# EAGLE design Modular-Sensor-Breakout-Board2 (EAGLE 5.12)

## Sheet 1 of 7
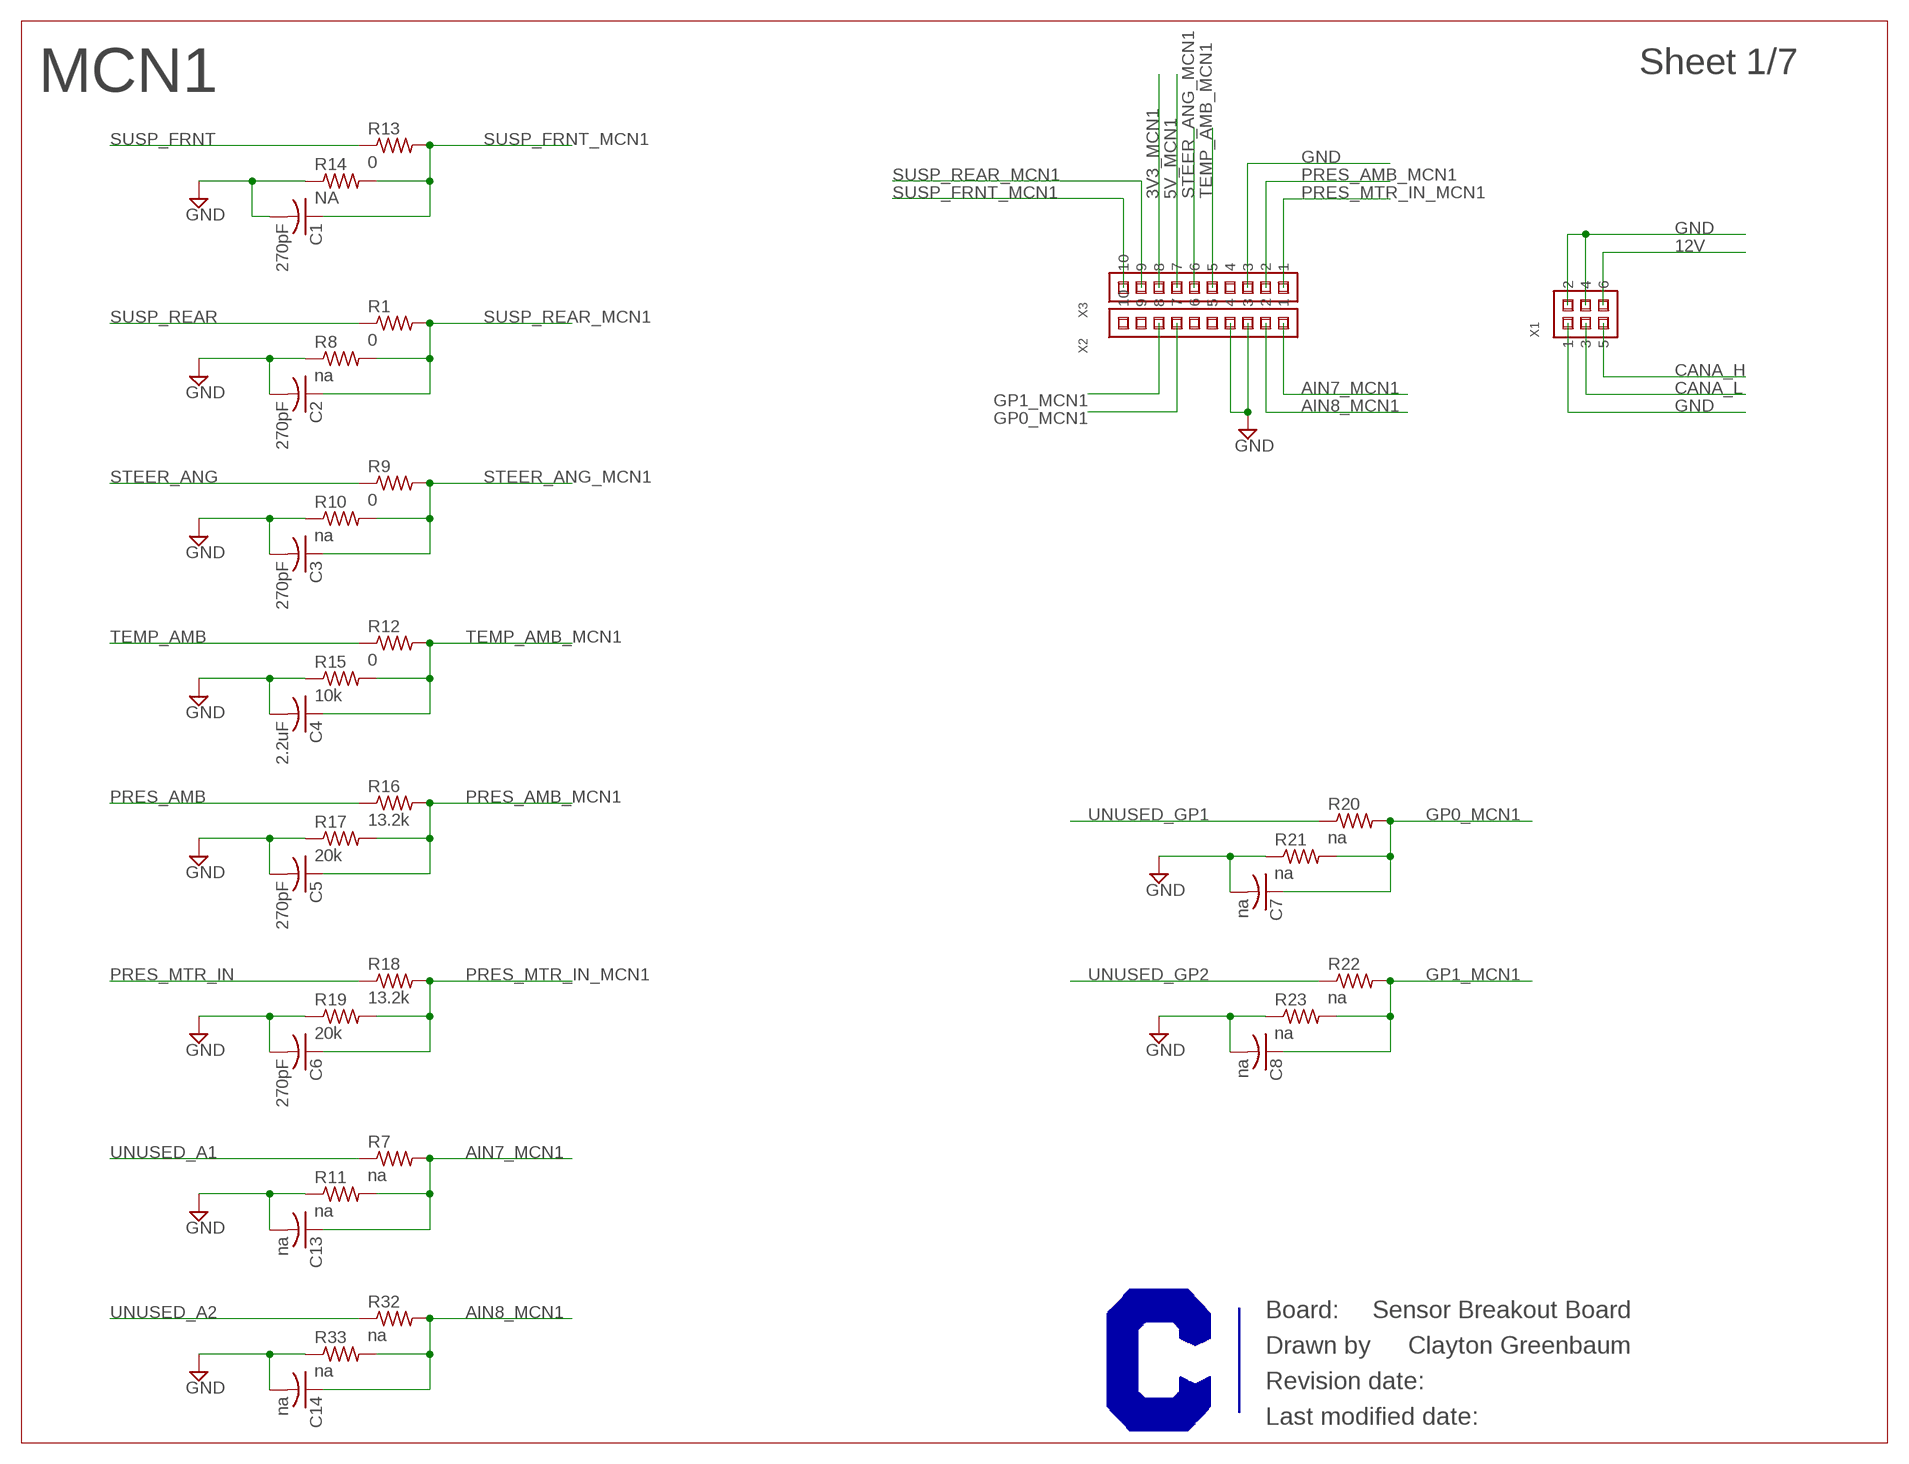
[diagram p0: schematic, sheet 1]

### Parts
C1  270pF  C-USC0603  [C0603]
C2  270pF  C-USC0603  [C0603]
C3  270pF  C-USC0603  [C0603]
C4  2.2uF  C-USC0603  [C0603]
C5  270pF  C-USC0603  [C0603]
C6  270pF  C-USC0603  [C0603]
C7  na  C-USC0603  [C0603]
C8  na  C-USC0603  [C0603]
C13  na  C-USC0603  [C0603]
C14  na  C-USC0603  [C0603]
R1  0  R-US_R0603  [R0603]
R7  na  R-US_R0603  [R0603]
R8  na  R-US_R0603  [R0603]
R9  0  R-US_R0603  [R0603]
R10  na  R-US_R0603  [R0603]
R11  na  R-US_R0603  [R0603]
R12  0  R-US_R0603  [R0603]
R13  0  R-US_R0603  [R0603]
R14  NA  R-US_R0603  [R0603]
R15  10k  R-US_R0603  [R0603]
R16  13.2k  R-US_R0603  [R0603]
R17  20k  R-US_R0603  [R0603]
R18  13.2k  R-US_R0603  [R0603]
R19  20k  R-US_R0603  [R0603]
R20  na  R-US_R0603  [R0603]
R21  na  R-US_R0603  [R0603]
R22  na  R-US_R0603  [R0603]
R23  na  R-US_R0603  [R0603]
R32  na  R-US_R0603  [R0603]
R33  na  R-US_R0603  [R0603]
X1  M22-71403XX  [M22-71403XX]
X2  M22-71310XX  [M22-71310XX]
X3  M22-71310XX  [M22-71310XX]

### Nets
3V3_MCN1: X3.8 ; also sheet 7
5V_MCN1: X3.7 ; also sheet 7
12V: X1.6 ; also sheet 2,3,4,5,6,7
AIN7_MCN1: C13.1 R7.2 R11.2 X2.1
AIN8_MCN1: C14.1 R32.2 R33.2 X2.2
CANA_H: X1.5 ; also sheet 2,3,5,6,7
CANA_L: X1.3 ; also sheet 2,3,5,6,7
GND: C1.2 C2.2 C3.2 C4.2 C5.2 C6.2 C7.2 C8.2 C13.2 C14.2 R8.1 R10.1 R11.1 R14.1 R15.1 R17.1 R19.1 R21.1 R23.1 R33.1 X1.1 X1.2 X1.4 X2.3 X2.4 X3.3 ; also sheet 2,3,4,5,6,7
GP0_MCN1: C7.1 R20.2 R21.2 X2.7
GP1_MCN1: C8.1 R22.2 R23.2 X2.8
PRES_AMB: R16.1 ; also sheet 7
PRES_AMB_MCN1: C5.1 R16.2 R17.2 X3.2
PRES_MTR_IN: R18.1 ; also sheet 7
PRES_MTR_IN_MCN1: C6.1 R18.2 R19.2 X3.1
STEER_ANG: R9.1 ; also sheet 7
STEER_ANG_MCN1: C3.1 R9.2 R10.2 X3.6
SUSP_FRNT: R13.1 ; also sheet 7
SUSP_FRNT_MCN1: C1.1 R13.2 R14.2 X3.10
SUSP_REAR: R1.1 ; also sheet 7
SUSP_REAR_MCN1: C2.1 R1.2 R8.2 X3.9
TEMP_AMB: R12.1 ; also sheet 7
TEMP_AMB_MCN1: C4.1 R12.2 R15.2 X3.5
UNUSED_A1: R7.1 ; also sheet 7
UNUSED_A2: R32.1 ; also sheet 7
UNUSED_GP1: R20.1 ; also sheet 7
UNUSED_GP2: R22.1 ; also sheet 7
Unconnected: X2.5 X2.6 X2.9 X2.10 X3.4

### Notes on the sheet
- MCN1
- Sensor Breakout Board
- Clayton Greenbaum

## Sheet 2 of 7
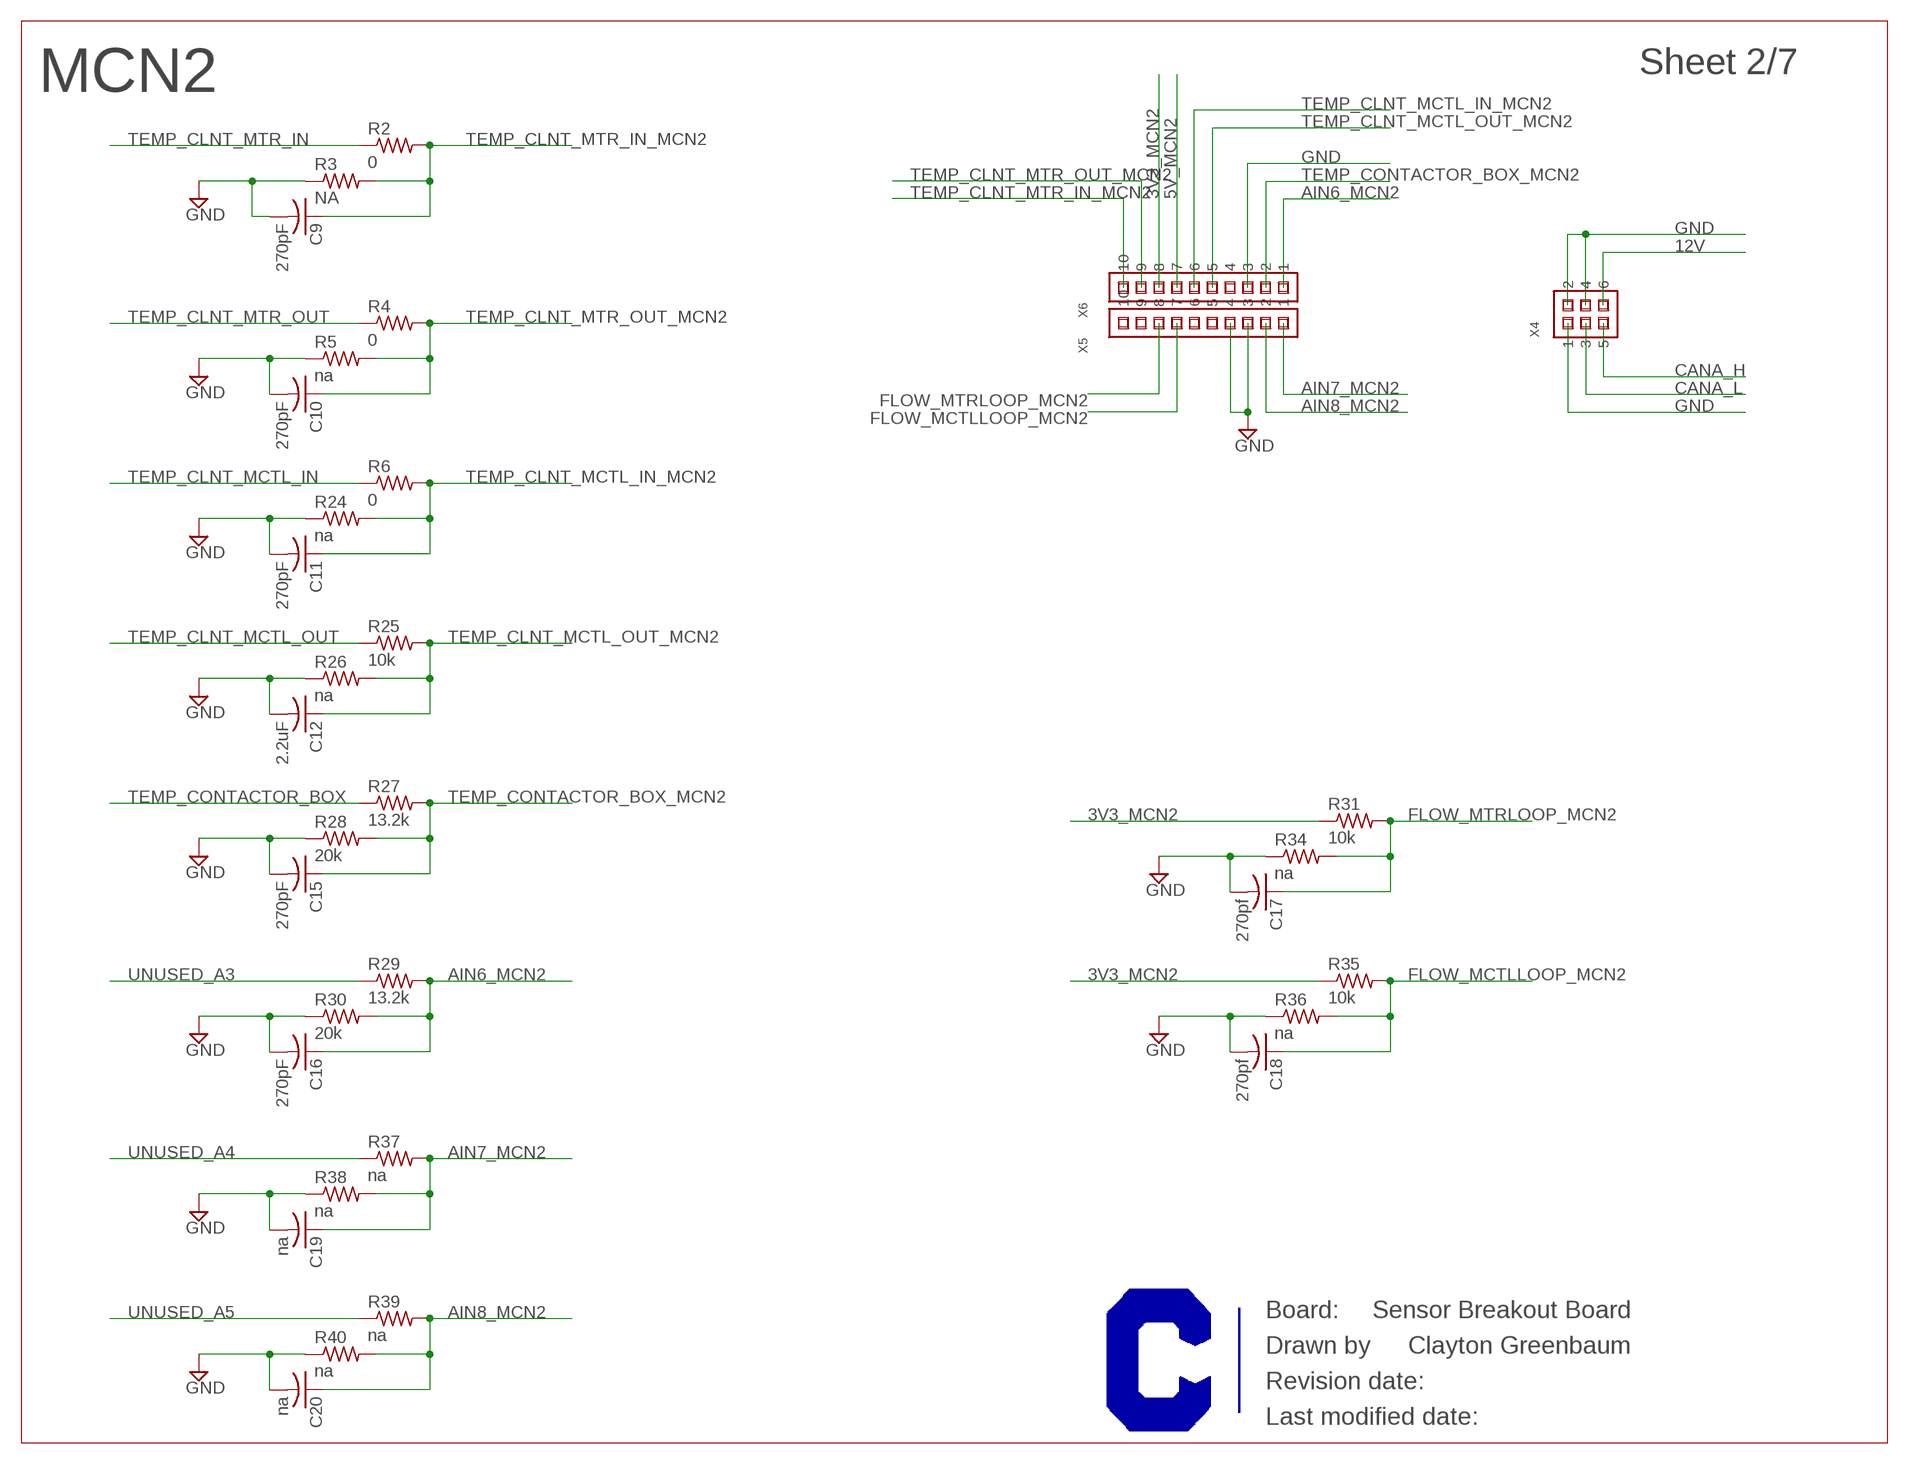
[diagram p1: schematic, sheet 2]

### Parts
C9  270pF  C-USC0603  [C0603]
C10  270pF  C-USC0603  [C0603]
C11  270pF  C-USC0603  [C0603]
C12  2.2uF  C-USC0603  [C0603]
C15  270pF  C-USC0603  [C0603]
C16  270pF  C-USC0603  [C0603]
C17  270pf  C-USC0603  [C0603]
C18  270pf  C-USC0603  [C0603]
C19  na  C-USC0603  [C0603]
C20  na  C-USC0603  [C0603]
R2  0  R-US_R0603  [R0603]
R3  NA  R-US_R0603  [R0603]
R4  0  R-US_R0603  [R0603]
R5  na  R-US_R0603  [R0603]
R6  0  R-US_R0603  [R0603]
R24  na  R-US_R0603  [R0603]
R25  10k  R-US_R0603  [R0603]
R26  na  R-US_R0603  [R0603]
R27  13.2k  R-US_R0603  [R0603]
R28  20k  R-US_R0603  [R0603]
R29  13.2k  R-US_R0603  [R0603]
R30  20k  R-US_R0603  [R0603]
R31  10k  R-US_R0603  [R0603]
R34  na  R-US_R0603  [R0603]
R35  10k  R-US_R0603  [R0603]
R36  na  R-US_R0603  [R0603]
R37  na  R-US_R0603  [R0603]
R38  na  R-US_R0603  [R0603]
R39  na  R-US_R0603  [R0603]
R40  na  R-US_R0603  [R0603]
X4  M22-71403XX  [M22-71403XX]
X5  M22-71310XX  [M22-71310XX]
X6  M22-71310XX  [M22-71310XX]

### Nets
3V3_MCN2: R31.1 R35.1 X6.8 ; also sheet 7
5V_MCN2: X6.7 ; also sheet 7
12V: X4.6 ; also sheet 1,3,4,5,6,7
AIN6_MCN2: C16.1 R29.2 R30.2 X6.1
AIN7_MCN2: C19.1 R37.2 R38.2 X5.1
AIN8_MCN2: C20.1 R39.2 R40.2 X5.2
CANA_H: X4.5 ; also sheet 1,3,5,6,7
CANA_L: X4.3 ; also sheet 1,3,5,6,7
FLOW_MCTLLOOP_MCN2: C18.1 R35.2 R36.2 X5.7
FLOW_MTRLOOP_MCN2: C17.1 R31.2 R34.2 X5.8
GND: C9.2 C10.2 C11.2 C12.2 C15.2 C16.2 C17.2 C18.2 C19.2 C20.2 R3.1 R5.1 R24.1 R26.1 R28.1 R30.1 R34.1 R36.1 R38.1 R40.1 X4.1 X4.2 X4.4 X5.3 X5.4 X6.3 ; also sheet 1,3,4,5,6,7
TEMP_CLNT_MCTL_IN: R6.1
TEMP_CLNT_MCTL_IN_MCN2: C11.1 R6.2 R24.2 X6.6
TEMP_CLNT_MCTL_OUT: R25.1
TEMP_CLNT_MCTL_OUT_MCN2: C12.1 R25.2 R26.2 X6.5
TEMP_CLNT_MTR_IN: R2.1
TEMP_CLNT_MTR_IN_MCN2: C9.1 R2.2 R3.2 X6.10
TEMP_CLNT_MTR_OUT: R4.1
TEMP_CLNT_MTR_OUT_MCN2: C10.1 R4.2 R5.2 X6.9
TEMP_CONTACTOR_BOX: R27.1
TEMP_CONTACTOR_BOX_MCN2: C15.1 R27.2 R28.2 X6.2
UNUSED_A3: R29.1
UNUSED_A4: R37.1
UNUSED_A5: R39.1 ; also sheet 3
Unconnected: X5.5 X5.6 X5.9 X5.10 X6.4

### Notes on the sheet
- MCN2
- Sensor Breakout Board
- Clayton Greenbaum

## Sheet 3 of 7
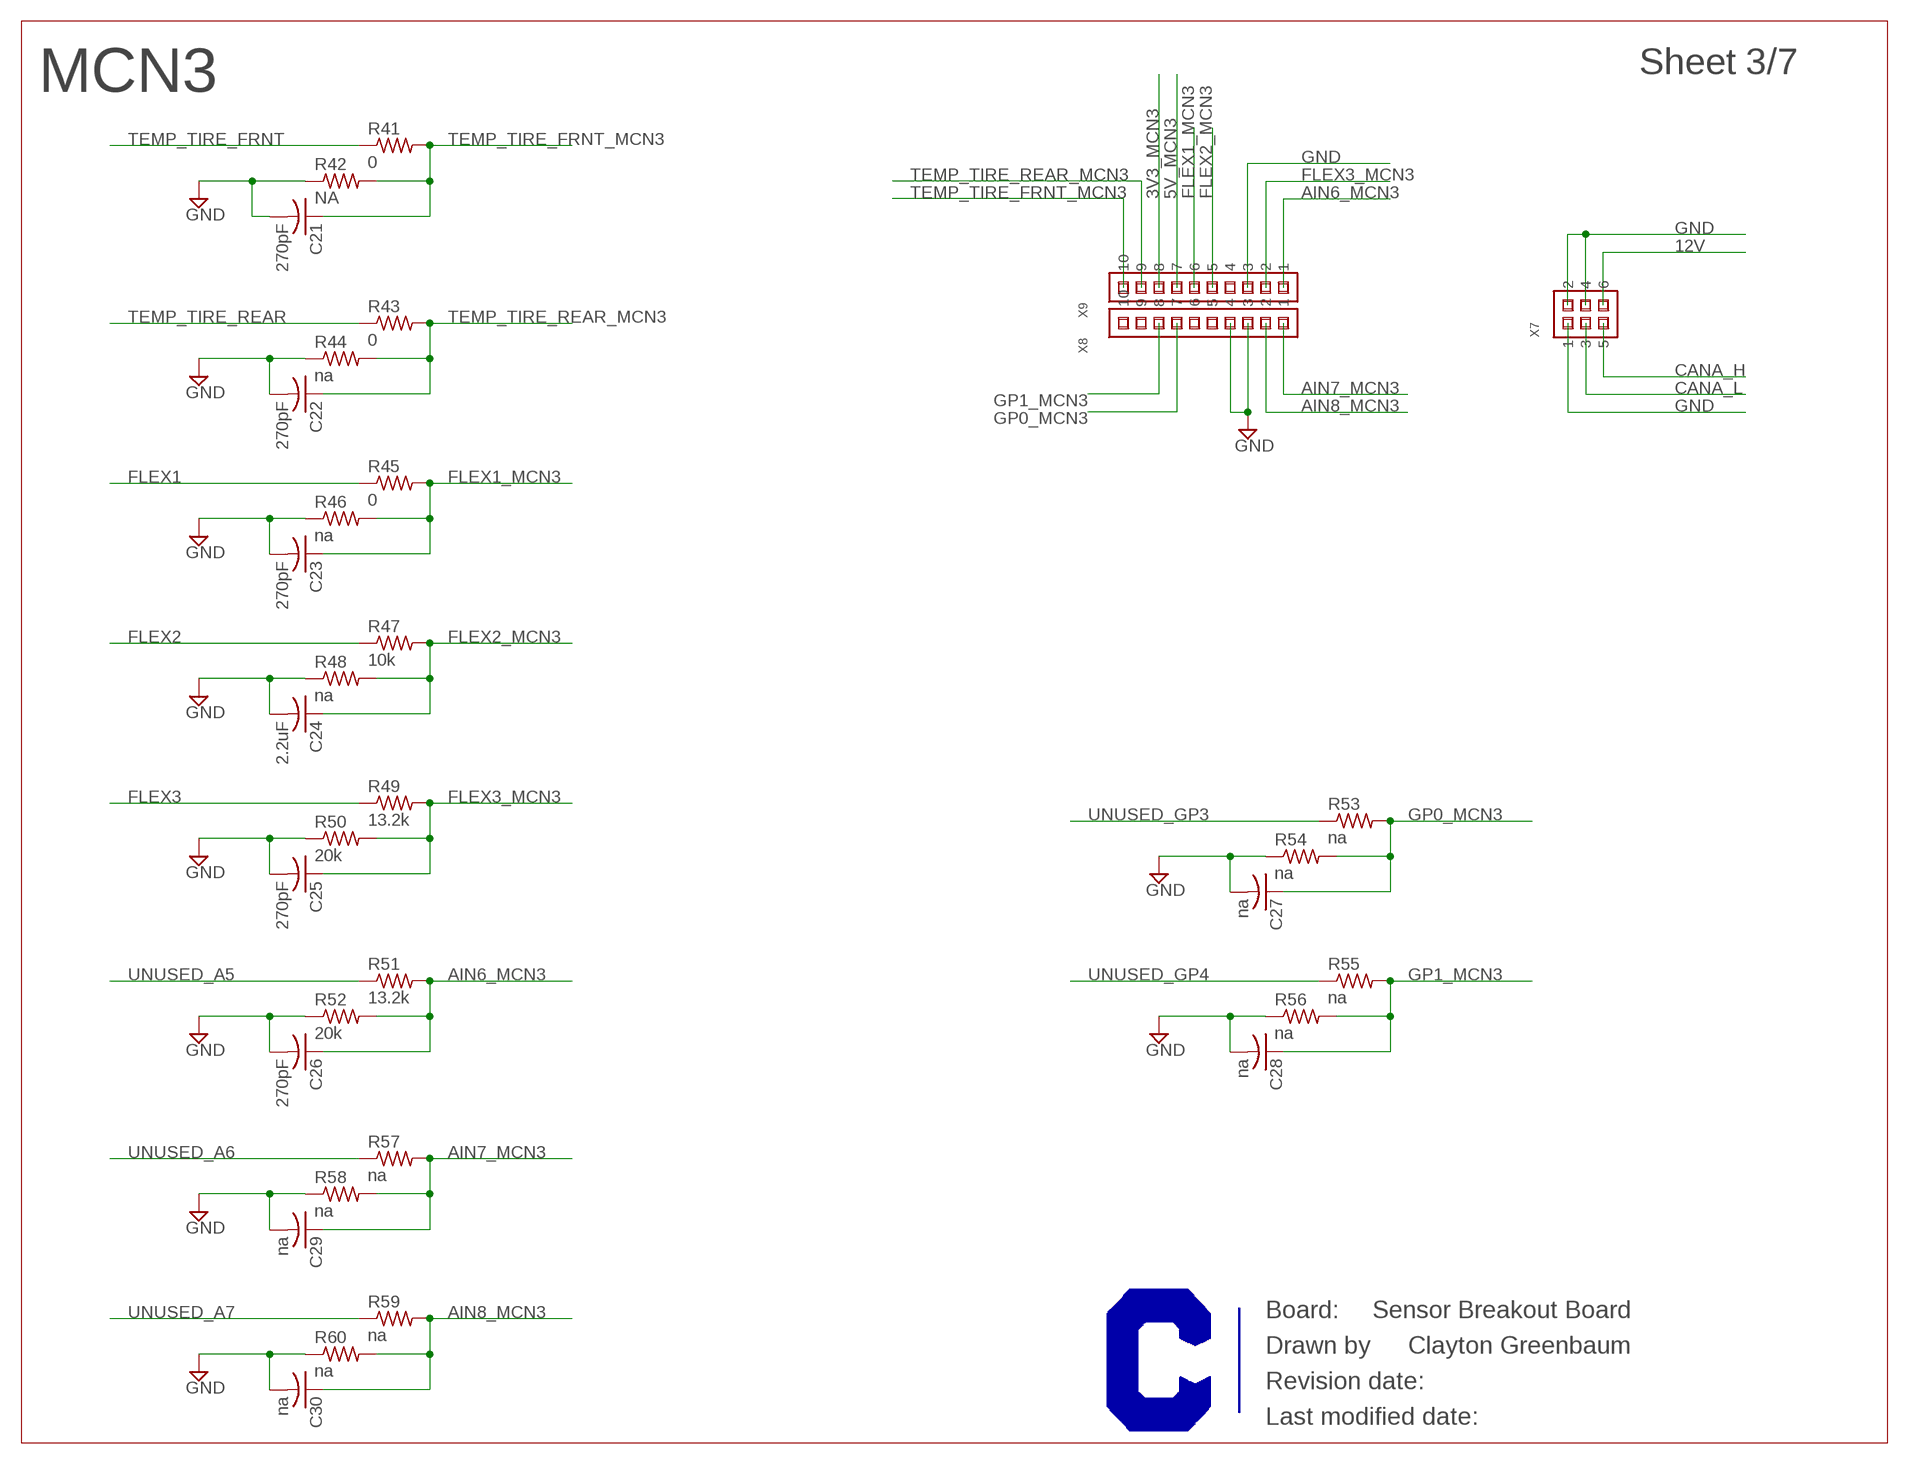
[diagram p2: schematic, sheet 3]

### Parts
C21  270pF  C-USC0603  [C0603]
C22  270pF  C-USC0603  [C0603]
C23  270pF  C-USC0603  [C0603]
C24  2.2uF  C-USC0603  [C0603]
C25  270pF  C-USC0603  [C0603]
C26  270pF  C-USC0603  [C0603]
C27  na  C-USC0603  [C0603]
C28  na  C-USC0603  [C0603]
C29  na  C-USC0603  [C0603]
C30  na  C-USC0603  [C0603]
R41  0  R-US_R0603  [R0603]
R42  NA  R-US_R0603  [R0603]
R43  0  R-US_R0603  [R0603]
R44  na  R-US_R0603  [R0603]
R45  0  R-US_R0603  [R0603]
R46  na  R-US_R0603  [R0603]
R47  10k  R-US_R0603  [R0603]
R48  na  R-US_R0603  [R0603]
R49  13.2k  R-US_R0603  [R0603]
R50  20k  R-US_R0603  [R0603]
R51  13.2k  R-US_R0603  [R0603]
R52  20k  R-US_R0603  [R0603]
R53  na  R-US_R0603  [R0603]
R54  na  R-US_R0603  [R0603]
R55  na  R-US_R0603  [R0603]
R56  na  R-US_R0603  [R0603]
R57  na  R-US_R0603  [R0603]
R58  na  R-US_R0603  [R0603]
R59  na  R-US_R0603  [R0603]
R60  na  R-US_R0603  [R0603]
X7  M22-71403XX  [M22-71403XX]
X8  M22-71310XX  [M22-71310XX]
X9  M22-71310XX  [M22-71310XX]

### Nets
3V3_MCN3: X9.8 ; also sheet 7
5V_MCN3: X9.7 ; also sheet 7
12V: X7.6 ; also sheet 1,2,4,5,6,7
AIN6_MCN3: C26.1 R51.2 R52.2 X9.1
AIN7_MCN3: C29.1 R57.2 R58.2 X8.1
AIN8_MCN3: C30.1 R59.2 R60.2 X8.2
CANA_H: X7.5 ; also sheet 1,2,5,6,7
CANA_L: X7.3 ; also sheet 1,2,5,6,7
FLEX1: R45.1
FLEX1_MCN3: C23.1 R45.2 R46.2 X9.6
FLEX2: R47.1
FLEX2_MCN3: C24.1 R47.2 R48.2 X9.5
FLEX3: R49.1
FLEX3_MCN3: C25.1 R49.2 R50.2 X9.2
GND: C21.2 C22.2 C23.2 C24.2 C25.2 C26.2 C27.2 C28.2 C29.2 C30.2 R42.1 R44.1 R46.1 R48.1 R50.1 R52.1 R54.1 R56.1 R58.1 R60.1 X7.1 X7.2 X7.4 X8.3 X8.4 X9.3 ; also sheet 1,2,4,5,6,7
GP0_MCN3: C27.1 R53.2 R54.2 X8.7
GP1_MCN3: C28.1 R55.2 R56.2 X8.8
TEMP_TIRE_FRNT: R41.1
TEMP_TIRE_FRNT_MCN3: C21.1 R41.2 R42.2 X9.10
TEMP_TIRE_REAR: R43.1
TEMP_TIRE_REAR_MCN3: C22.1 R43.2 R44.2 X9.9
UNUSED_A5: R51.1 ; also sheet 2
UNUSED_A6: R57.1
UNUSED_A7: R59.1
UNUSED_GP3: R53.1
UNUSED_GP4: R55.1
Unconnected: X8.5 X8.6 X8.9 X8.10 X9.4

### Notes on the sheet
- MCN3
- Sensor Breakout Board
- Clayton Greenbaum

## Sheet 4 of 7
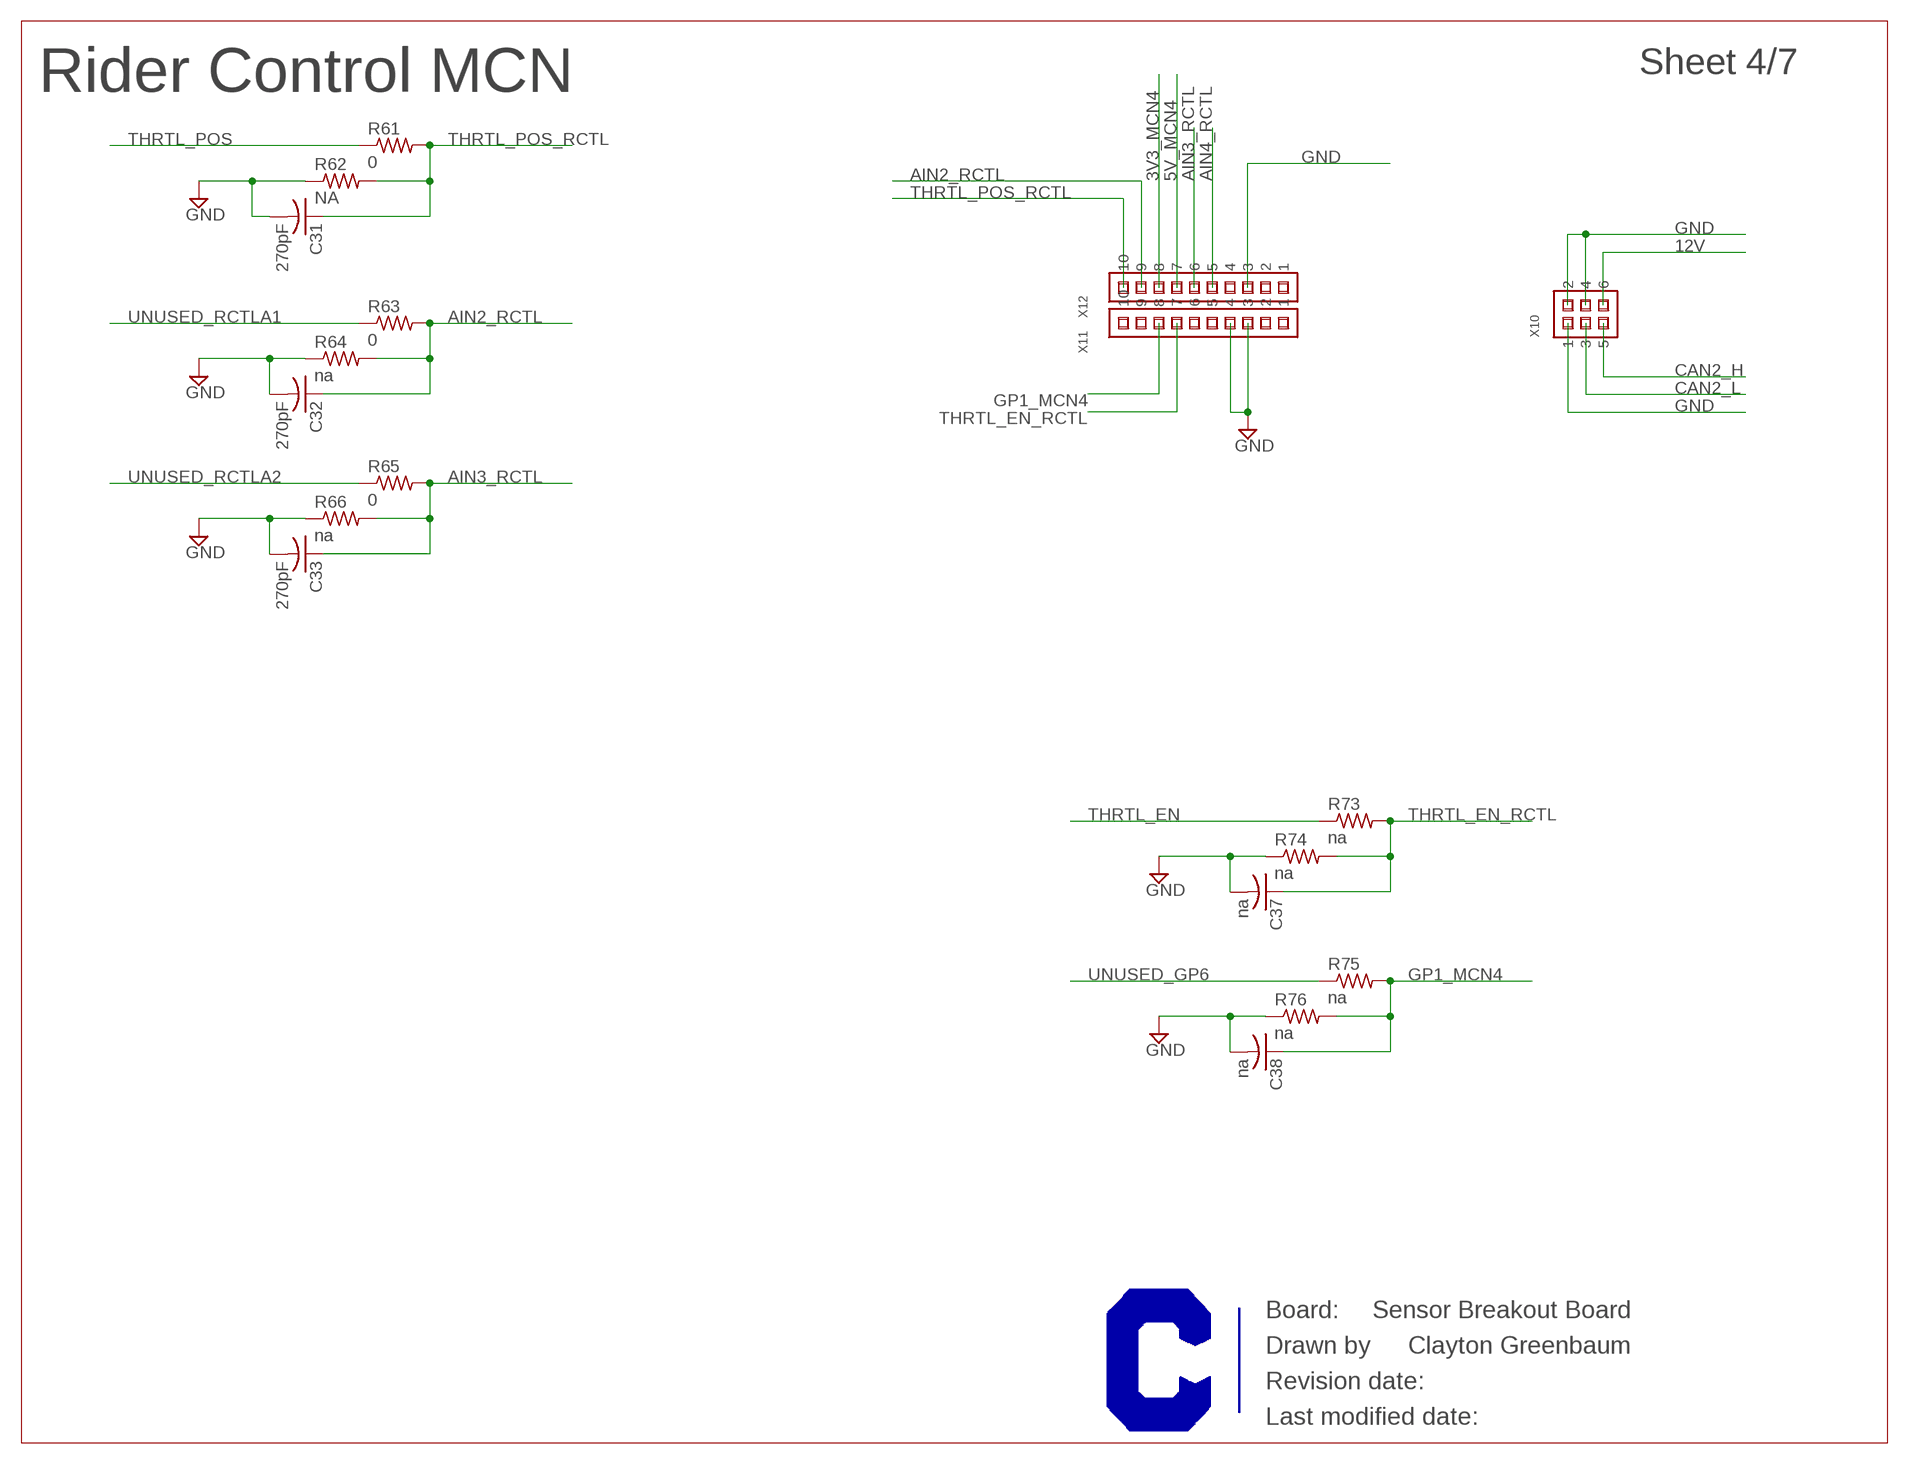
[diagram p3: schematic, sheet 4]

### Parts
C31  270pF  C-USC0603  [C0603]
C32  270pF  C-USC0603  [C0603]
C33  270pF  C-USC0603  [C0603]
C37  na  C-USC0603  [C0603]
C38  na  C-USC0603  [C0603]
R61  0  R-US_R0603  [R0603]
R62  NA  R-US_R0603  [R0603]
R63  0  R-US_R0603  [R0603]
R64  na  R-US_R0603  [R0603]
R65  0  R-US_R0603  [R0603]
R66  na  R-US_R0603  [R0603]
R73  na  R-US_R0603  [R0603]
R74  na  R-US_R0603  [R0603]
R75  na  R-US_R0603  [R0603]
R76  na  R-US_R0603  [R0603]
X10  M22-71403XX  [M22-71403XX]
X11  M22-71310XX  [M22-71310XX]
X12  M22-71310XX  [M22-71310XX]

### Nets
3V3_MCN4: X12.8
5V_MCN4: X12.7
12V: X10.6 ; also sheet 1,2,3,5,6,7
AIN2_RCTL: C32.1 R63.2 R64.2 X12.9
AIN3_RCTL: C33.1 R65.2 R66.2 X12.6
AIN4_RCTL: X12.5
CAN2_H: X10.5 ; also sheet 6,7
CAN2_L: X10.3 ; also sheet 6,7
GND: C31.2 C32.2 C33.2 C37.2 C38.2 R62.1 R64.1 R66.1 R74.1 R76.1 X10.1 X10.2 X10.4 X11.3 X11.4 X12.3 ; also sheet 1,2,3,5,6,7
GP1_MCN4: C38.1 R75.2 R76.2 X11.8
THRTL_EN: R73.1
THRTL_EN_RCTL: C37.1 R73.2 R74.2 X11.7
THRTL_POS: R61.1
THRTL_POS_RCTL: C31.1 R61.2 R62.2 X12.10
UNUSED_GP6: R75.1
UNUSED_RCTLA1: R63.1
UNUSED_RCTLA2: R65.1
Unconnected: X11.1 X11.2 X11.5 X11.6 X11.9 X11.10 X12.1 X12.2 X12.4

### Notes on the sheet
- Rider Control MCN
- Sensor Breakout Board
- Clayton Greenbaum

## Sheet 5 of 7
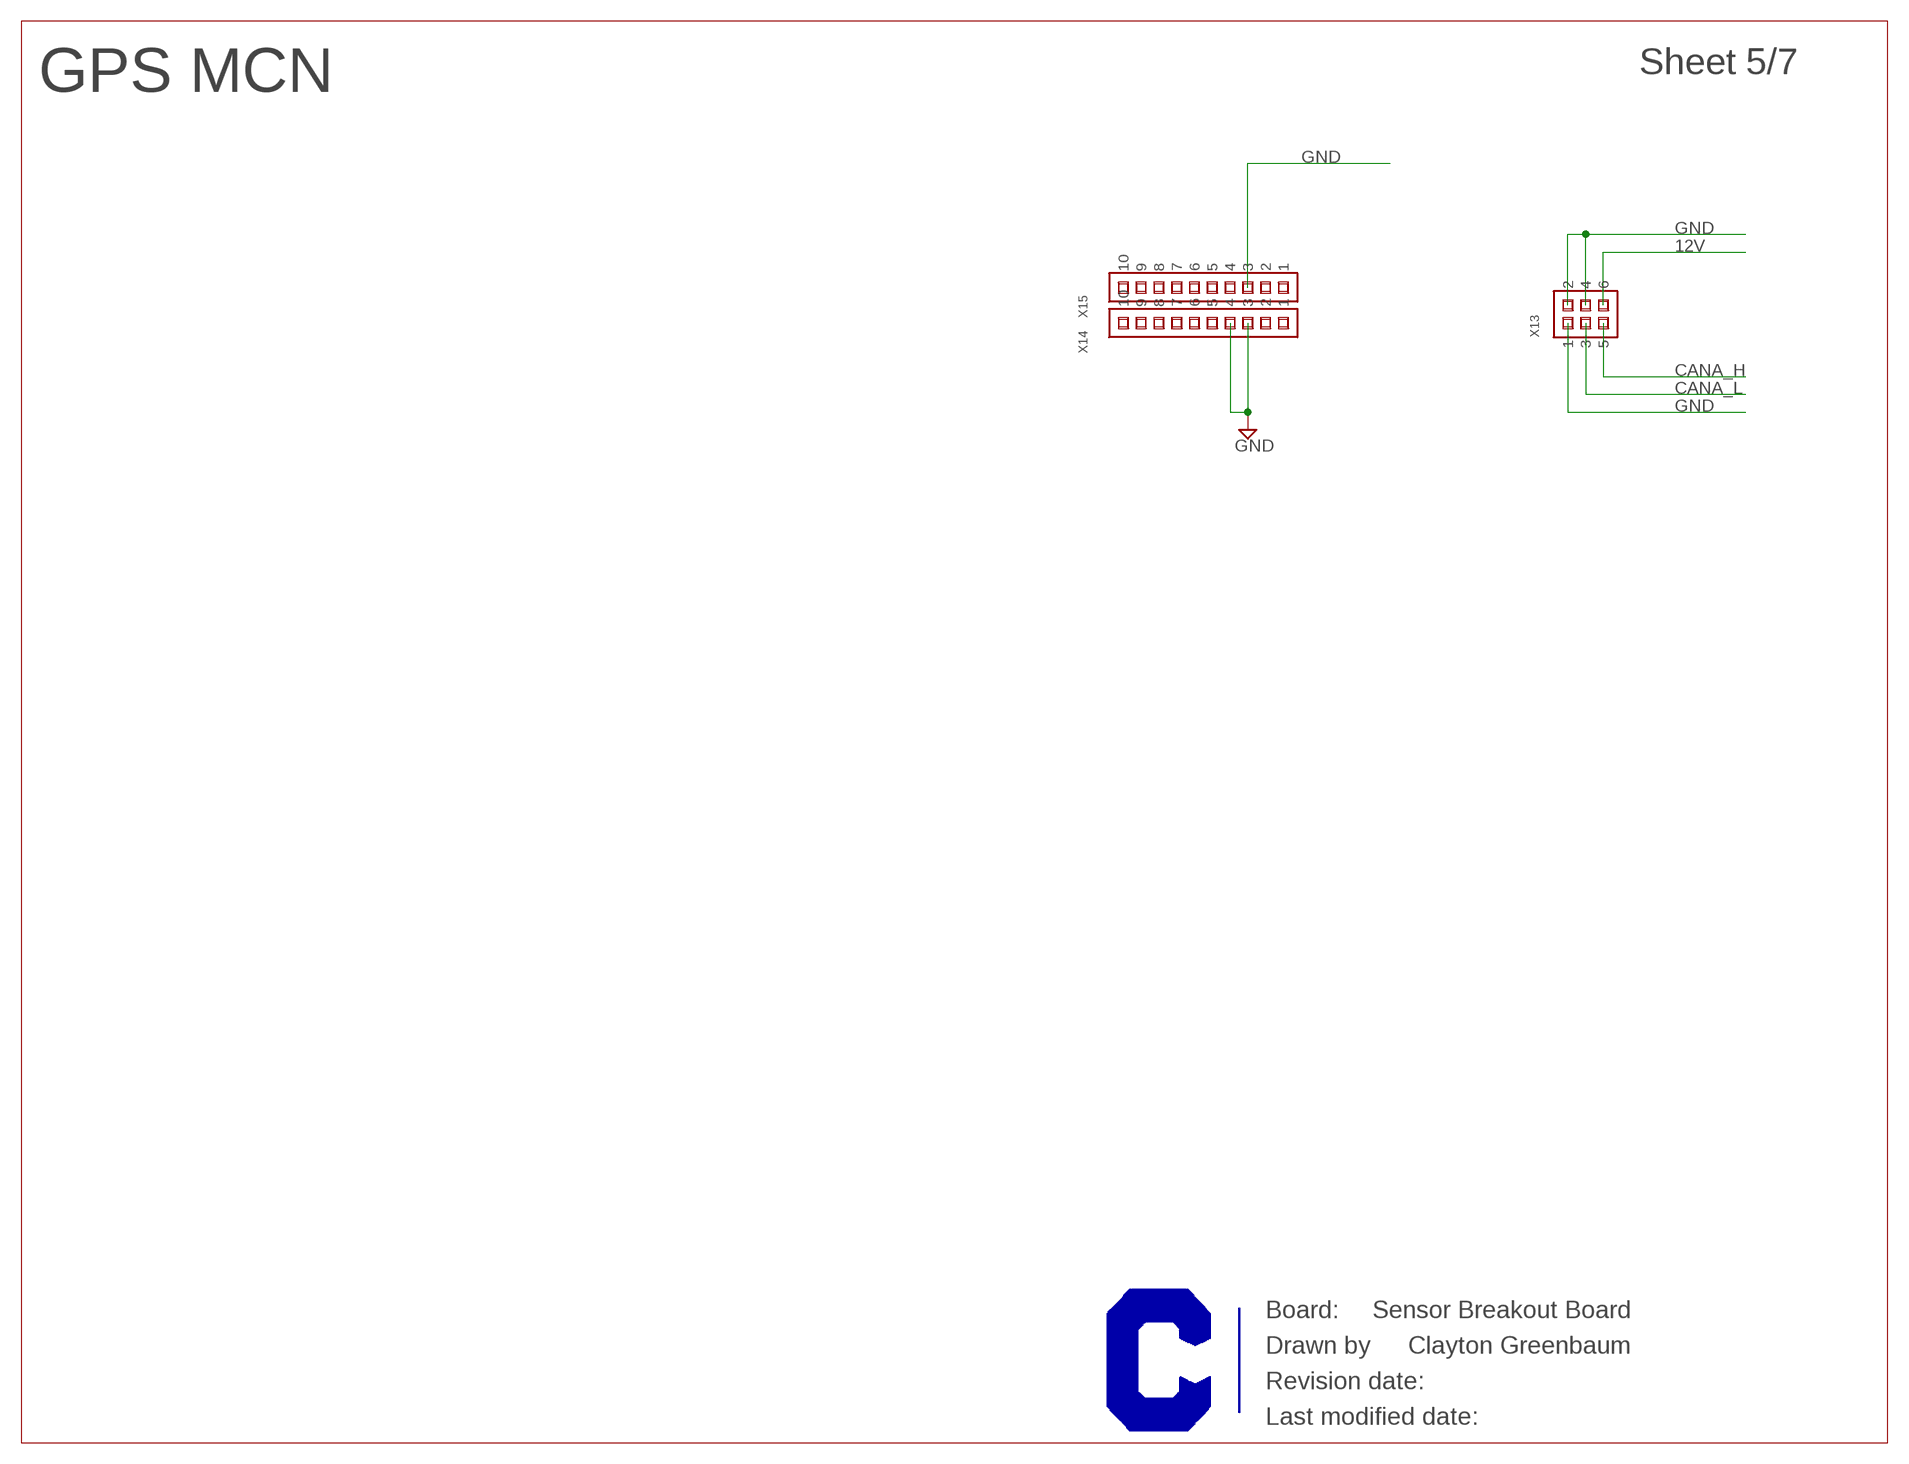
[diagram p4: schematic, sheet 5]

### Parts
X13  M22-71403XX  [M22-71403XX]
X14  M22-71310XX  [M22-71310XX]
X15  M22-71310XX  [M22-71310XX]

### Nets
12V: X13.6 ; also sheet 1,2,3,4,6,7
CANA_H: X13.5 ; also sheet 1,2,3,6,7
CANA_L: X13.3 ; also sheet 1,2,3,6,7
GND: X13.1 X13.2 X13.4 X14.3 X14.4 X15.3 ; also sheet 1,2,3,4,6,7
Unconnected: X14.1 X14.2 X14.5 X14.6 X14.7 X14.8 X14.9 X14.10 X15.1 X15.2 X15.4 X15.5 X15.6 X15.7 X15.8 X15.9 X15.10

### Notes on the sheet
- GPS MCN
- Sensor Breakout Board
- Clayton Greenbaum

## Sheet 6 of 7
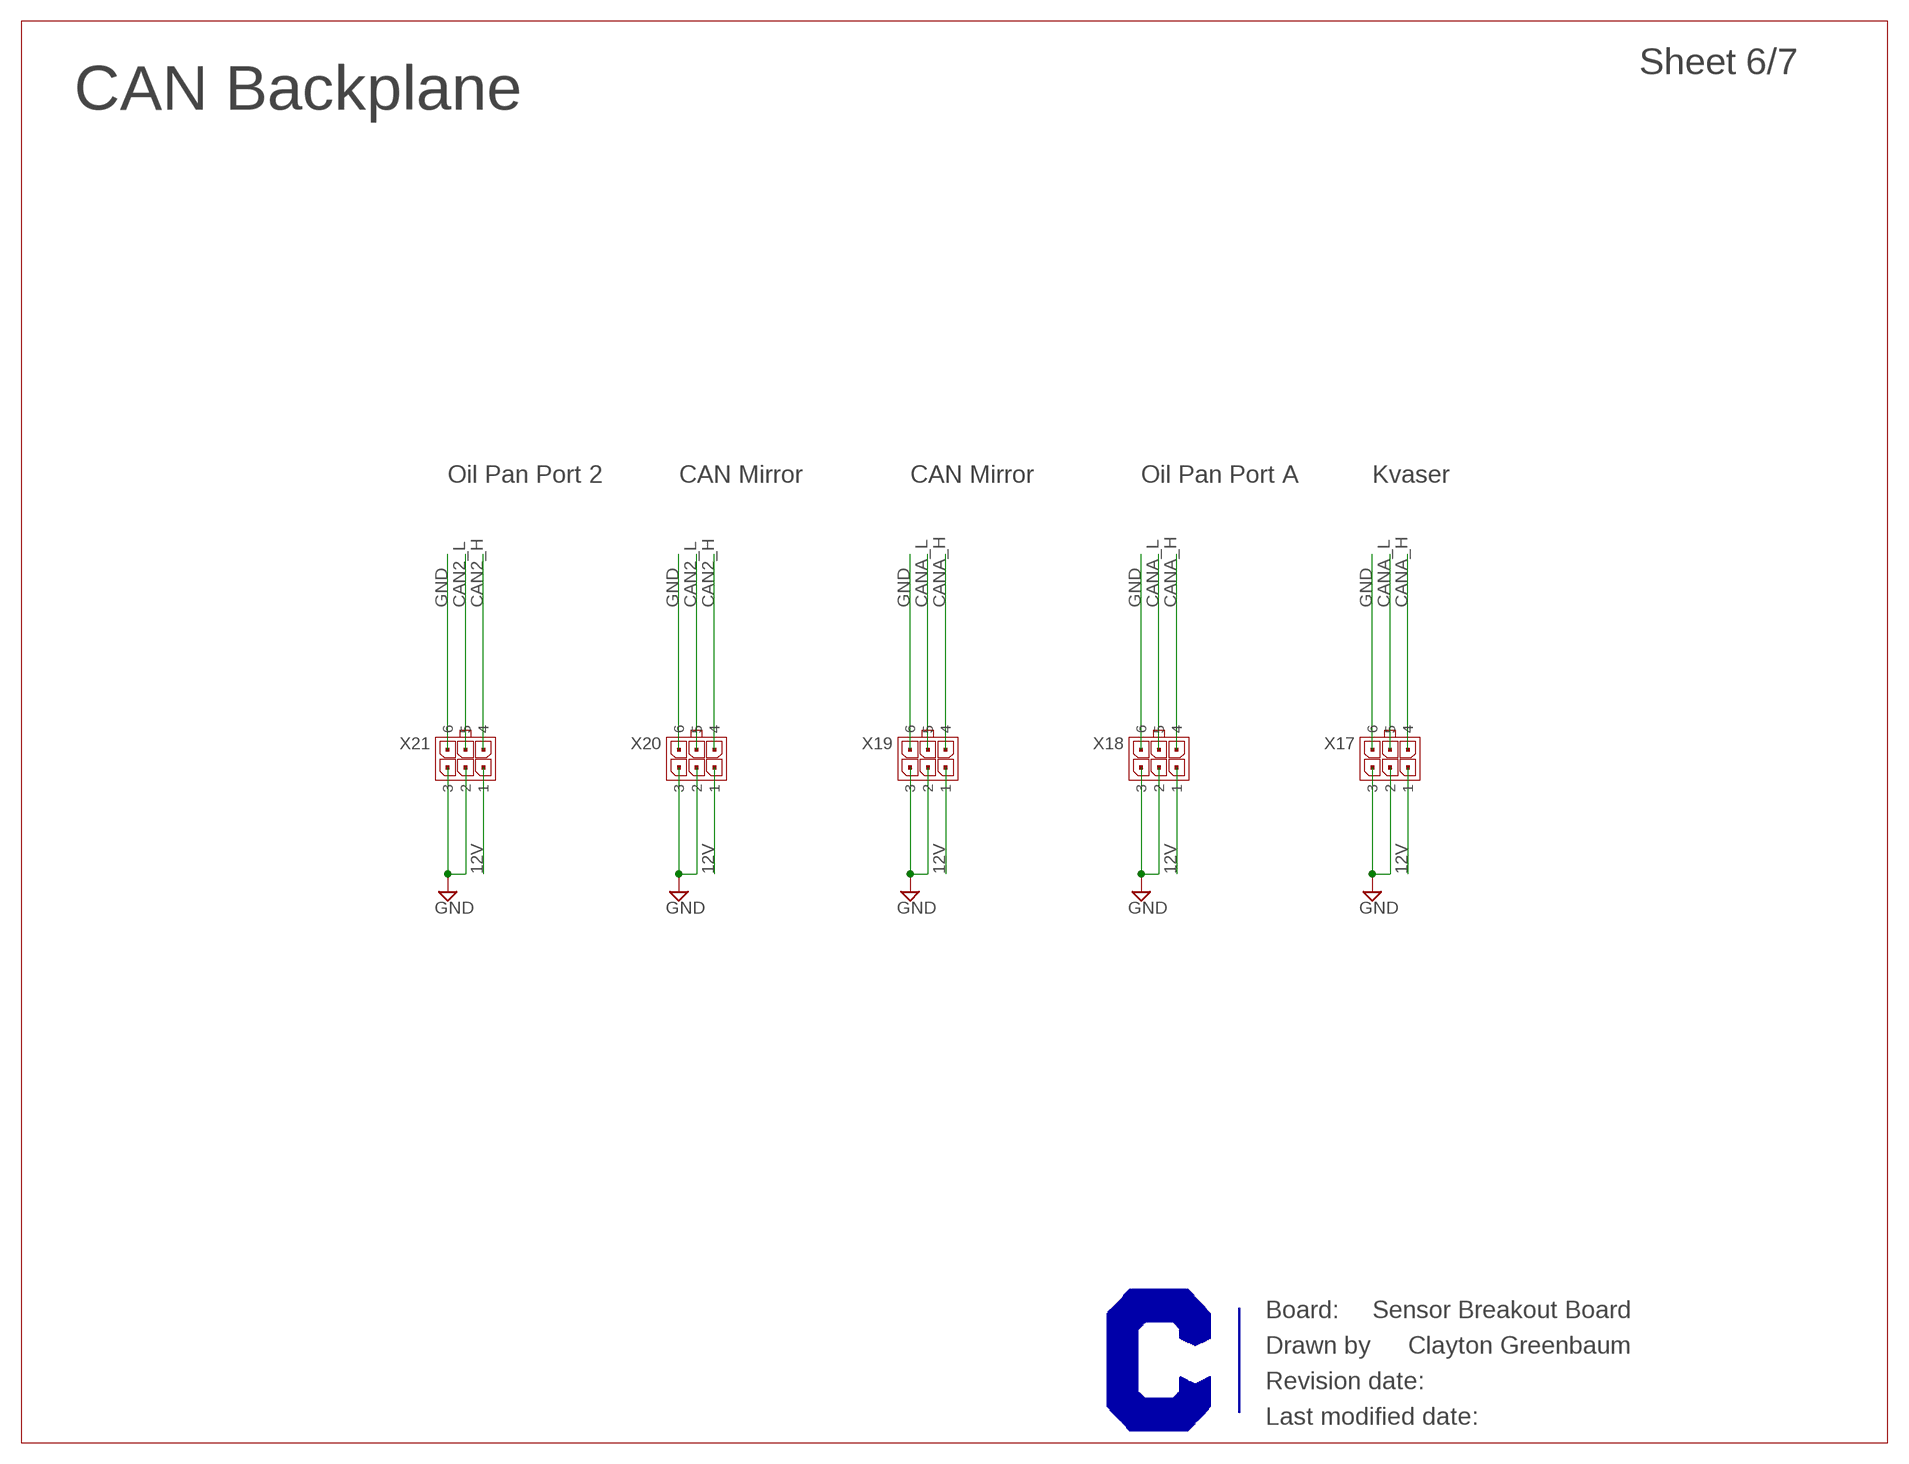
[diagram p5: schematic, sheet 6]

### Parts
X17  MICROFIT-06-DUAL-RA-SMD  [MICROFIT-6-DUAL-RA-SMD]
X18  MICROFIT-06-DUAL-RA-SMD  [MICROFIT-6-DUAL-RA-SMD]
X19  MICROFIT-06-DUAL-RA-SMD  [MICROFIT-6-DUAL-RA-SMD]
X20  MICROFIT-06-DUAL-RA-SMD  [MICROFIT-6-DUAL-RA-SMD]
X21  MICROFIT-06-DUAL-RA-SMD  [MICROFIT-6-DUAL-RA-SMD]

### Nets
12V: X17.1 X18.1 X19.1 X20.1 X21.1 ; also sheet 1,2,3,4,5,7
CAN2_H: X20.4 X21.4 ; also sheet 4,7
CAN2_L: X20.5 X21.5 ; also sheet 4,7
CANA_H: X17.4 X18.4 X19.4 ; also sheet 1,2,3,5,7
CANA_L: X17.5 X18.5 X19.5 ; also sheet 1,2,3,5,7
GND: X17.2 X17.3 X17.6 X18.2 X18.3 X18.6 X19.2 X19.3 X19.6 X20.2 X20.3 X20.6 X21.2 X21.3 X21.6 ; also sheet 1,2,3,4,5,7

### Notes on the sheet
- CAN Backplane
- Oil Pan Port 2 | CAN Mirror | CAN Mirror | Oil Pan Port A | Kvaser
- Sensor Breakout Board
- Clayton Greenbaum

## Sheet 7 of 7
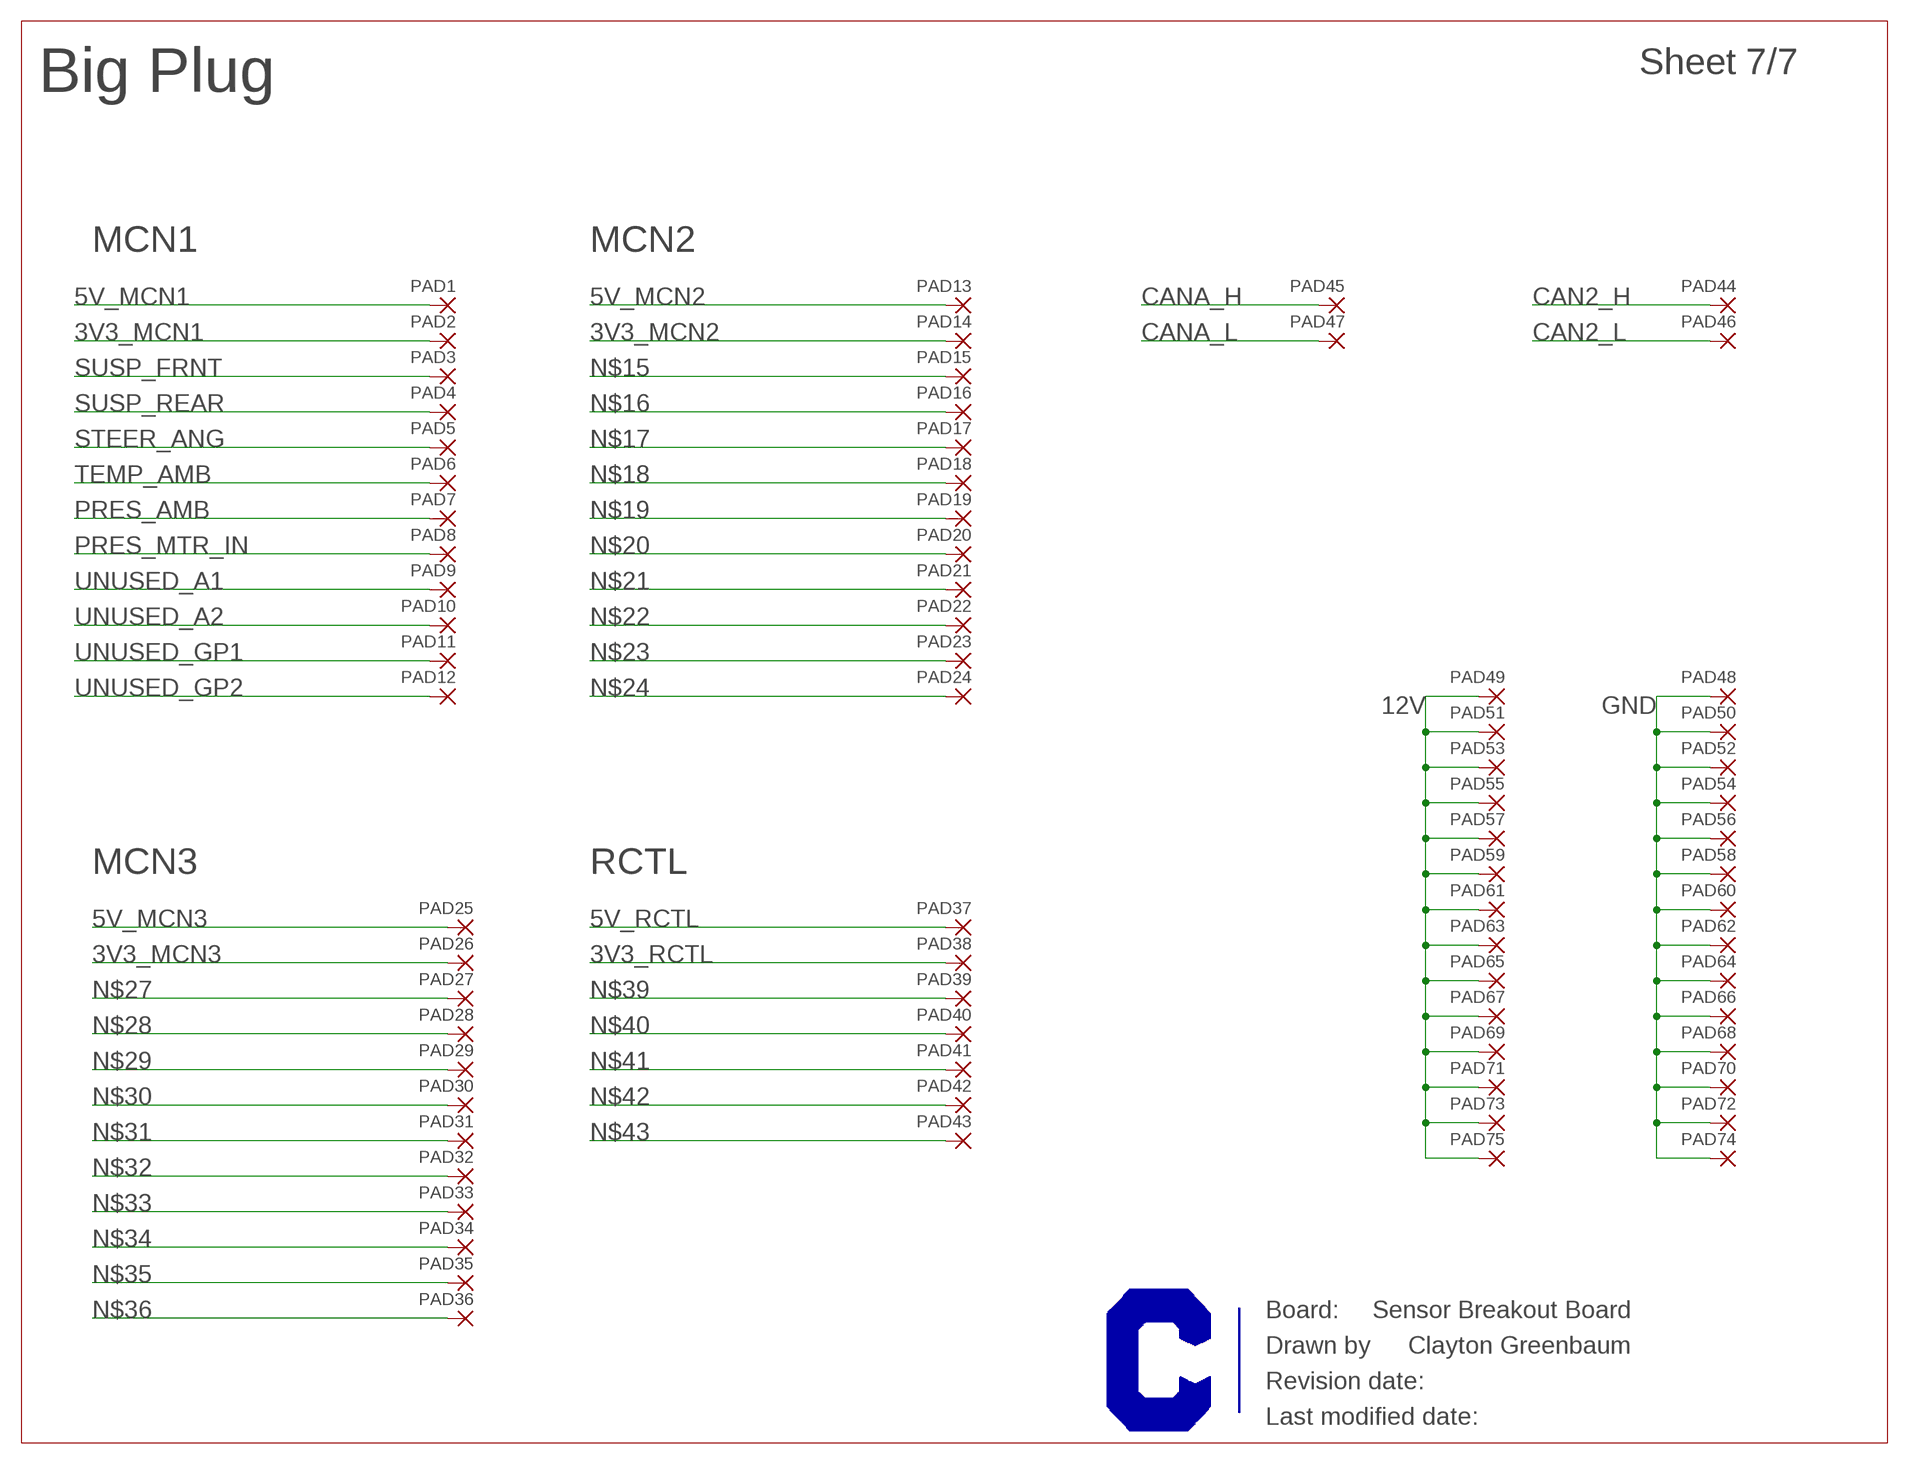
[diagram p6: schematic, sheet 7]

### Parts
PAD1  2,54/0,9  [2,54/0,9]
PAD2  2,54/0,9  [2,54/0,9]
PAD3  2,54/0,9  [2,54/0,9]
PAD4  2,54/0,9  [2,54/0,9]
PAD5  2,54/0,9  [2,54/0,9]
PAD6  2,54/0,9  [2,54/0,9]
PAD7  2,54/0,9  [2,54/0,9]
PAD8  2,54/0,9  [2,54/0,9]
PAD9  2,54/0,9  [2,54/0,9]
PAD10  2,54/0,9  [2,54/0,9]
PAD11  2,54/0,9  [2,54/0,9]
PAD12  2,54/0,9  [2,54/0,9]
PAD13  2,54/0,9  [2,54/0,9]
PAD14  2,54/0,9  [2,54/0,9]
PAD15  2,54/0,9  [2,54/0,9]
PAD16  2,54/0,9  [2,54/0,9]
PAD17  2,54/0,9  [2,54/0,9]
PAD18  2,54/0,9  [2,54/0,9]
PAD19  2,54/0,9  [2,54/0,9]
PAD20  2,54/0,9  [2,54/0,9]
PAD21  2,54/0,9  [2,54/0,9]
PAD22  2,54/0,9  [2,54/0,9]
PAD23  2,54/0,9  [2,54/0,9]
PAD24  2,54/0,9  [2,54/0,9]
PAD25  2,54/0,9  [2,54/0,9]
PAD26  2,54/0,9  [2,54/0,9]
PAD27  2,54/0,9  [2,54/0,9]
PAD28  2,54/0,9  [2,54/0,9]
PAD29  2,54/0,9  [2,54/0,9]
PAD30  2,54/0,9  [2,54/0,9]
PAD31  2,54/0,9  [2,54/0,9]
PAD32  2,54/0,9  [2,54/0,9]
PAD33  2,54/0,9  [2,54/0,9]
PAD34  2,54/0,9  [2,54/0,9]
PAD35  2,54/0,9  [2,54/0,9]
PAD36  2,54/0,9  [2,54/0,9]
PAD37  2,54/0,9  [2,54/0,9]
PAD38  2,54/0,9  [2,54/0,9]
PAD39  2,54/0,9  [2,54/0,9]
PAD40  2,54/0,9  [2,54/0,9]
PAD41  2,54/0,9  [2,54/0,9]
PAD42  2,54/0,9  [2,54/0,9]
PAD43  2,54/0,9  [2,54/0,9]
PAD44  2,54/0,9  [2,54/0,9]
PAD45  2,54/0,9  [2,54/0,9]
PAD46  2,54/0,9  [2,54/0,9]
PAD47  2,54/0,9  [2,54/0,9]
PAD48  2,54/0,9  [2,54/0,9]
PAD49  2,54/0,9  [2,54/0,9]
PAD50  2,54/0,9  [2,54/0,9]
PAD51  2,54/0,9  [2,54/0,9]
PAD52  2,54/0,9  [2,54/0,9]
PAD53  2,54/0,9  [2,54/0,9]
PAD54  2,54/0,9  [2,54/0,9]
PAD55  2,54/0,9  [2,54/0,9]
PAD56  2,54/0,9  [2,54/0,9]
PAD57  2,54/0,9  [2,54/0,9]
PAD58  2,54/0,9  [2,54/0,9]
PAD59  2,54/0,9  [2,54/0,9]
PAD60  2,54/0,9  [2,54/0,9]
PAD61  2,54/0,9  [2,54/0,9]
PAD62  2,54/0,9  [2,54/0,9]
PAD63  2,54/0,9  [2,54/0,9]
PAD64  2,54/0,9  [2,54/0,9]
PAD65  2,54/0,9  [2,54/0,9]
PAD66  2,54/0,9  [2,54/0,9]
PAD67  2,54/0,9  [2,54/0,9]
PAD68  2,54/0,9  [2,54/0,9]
PAD69  2,54/0,9  [2,54/0,9]
PAD70  2,54/0,9  [2,54/0,9]
PAD71  2,54/0,9  [2,54/0,9]
PAD72  2,54/0,9  [2,54/0,9]
PAD73  2,54/0,9  [2,54/0,9]
PAD74  2,54/0,9  [2,54/0,9]
PAD75  2,54/0,9  [2,54/0,9]

### Nets
3V3_MCN1: PAD2.1(P) ; also sheet 1
3V3_MCN2: PAD14.1(P) ; also sheet 2
3V3_MCN3: PAD26.1(P) ; also sheet 3
3V3_RCTL: PAD38.1(P)
5V_MCN1: PAD1.1(P) ; also sheet 1
5V_MCN2: PAD13.1(P) ; also sheet 2
5V_MCN3: PAD25.1(P) ; also sheet 3
5V_RCTL: PAD37.1(P)
12V: PAD49.1(P) PAD51.1(P) PAD53.1(P) PAD55.1(P) PAD57.1(P) PAD59.1(P) PAD61.1(P) PAD63.1(P) PAD65.1(P) PAD67.1(P) PAD69.1(P) PAD71.1(P) PAD73.1(P) PAD75.1(P) ; also sheet 1,2,3,4,5,6
CAN2_H: PAD44.1(P) ; also sheet 4,6
CAN2_L: PAD46.1(P) ; also sheet 4,6
CANA_H: PAD45.1(P) ; also sheet 1,2,3,5,6
CANA_L: PAD47.1(P) ; also sheet 1,2,3,5,6
GND: PAD48.1(P) PAD50.1(P) PAD52.1(P) PAD54.1(P) PAD56.1(P) PAD58.1(P) PAD60.1(P) PAD62.1(P) PAD64.1(P) PAD66.1(P) PAD68.1(P) PAD70.1(P) PAD72.1(P) PAD74.1(P) ; also sheet 1,2,3,4,5,6
N$15: PAD15.1(P)
N$16: PAD16.1(P)
N$17: PAD17.1(P)
N$18: PAD18.1(P)
N$19: PAD19.1(P)
N$20: PAD20.1(P)
N$21: PAD21.1(P)
N$22: PAD22.1(P)
N$23: PAD23.1(P)
N$24: PAD24.1(P)
N$27: PAD27.1(P)
N$28: PAD28.1(P)
N$29: PAD29.1(P)
N$30: PAD30.1(P)
N$31: PAD31.1(P)
N$32: PAD32.1(P)
N$33: PAD33.1(P)
N$34: PAD34.1(P)
N$35: PAD35.1(P)
N$36: PAD36.1(P)
N$39: PAD39.1(P)
N$40: PAD40.1(P)
N$41: PAD41.1(P)
N$42: PAD42.1(P)
N$43: PAD43.1(P)
PRES_AMB: PAD7.1(P) ; also sheet 1
PRES_MTR_IN: PAD8.1(P) ; also sheet 1
STEER_ANG: PAD5.1(P) ; also sheet 1
SUSP_FRNT: PAD3.1(P) ; also sheet 1
SUSP_REAR: PAD4.1(P) ; also sheet 1
TEMP_AMB: PAD6.1(P) ; also sheet 1
UNUSED_A1: PAD9.1(P) ; also sheet 1
UNUSED_A2: PAD10.1(P) ; also sheet 1
UNUSED_GP1: PAD11.1(P) ; also sheet 1
UNUSED_GP2: PAD12.1(P) ; also sheet 1

### Notes on the sheet
- Big Plug
- MCN1 | MCN2
- MCN3 | RCTL
- Sensor Breakout Board
- Clayton Greenbaum

## Library data of the parts
C1-C33 C37 C38 = resistor:C-US: CAPACITOR, American symbol
PAD1-PAD75 = wirepad:2,54/0,9: THROUGH-HOLE PAD
R1-R66 R73-R76 = rcl:R-US_: RESISTOR, American symbol
X1 X4 X7 X10 X13 = Harwin:M22-71403XX: M22-71403XX - 2x3 pos female header assy, 2.0mm pitch Datasheet: https://cdn.harwin.com/pdfs/M22-714.pdf; PARTNO: M22-7140342
X2 X3 X5 X6 X8 X9 X11 X12 X14 X15 = Harwin:M22-71310XX: Harwin M22-71310XX - 10pos single row female pin hdr, 2mm pitch Datasheet: https://cdn.harwin.com/pdfs/M22-713.pdf; PARTNO: M22-7131042
X17-X21 = Molex:MICROFIT-06-DUAL: Molex MicroFit 3.00mm Pitch Header, Surface Mount, Dual Row, 6 Circuits Note, November 2014: These come in three styles: Through-hole, with metal clip retention to PCB (not currently represented) (cheapest) SMD, with solder tab retention (-SMD) (more expensive, commonly stocked) SMD, with metal clip retention (-SMD-CLIP_RETENTION) (most expensive, not often stocked) Please use them in that order! Drawing: http://www.molex.com/pdm_docs/sd/430450609_sd.pdf (right-angle) Information: http://www.molex.com/molex/products/datasheet.jsp?part=active/0430450618_PCB_HEADERS.xml; PARTNO: 43045-0609

## Board
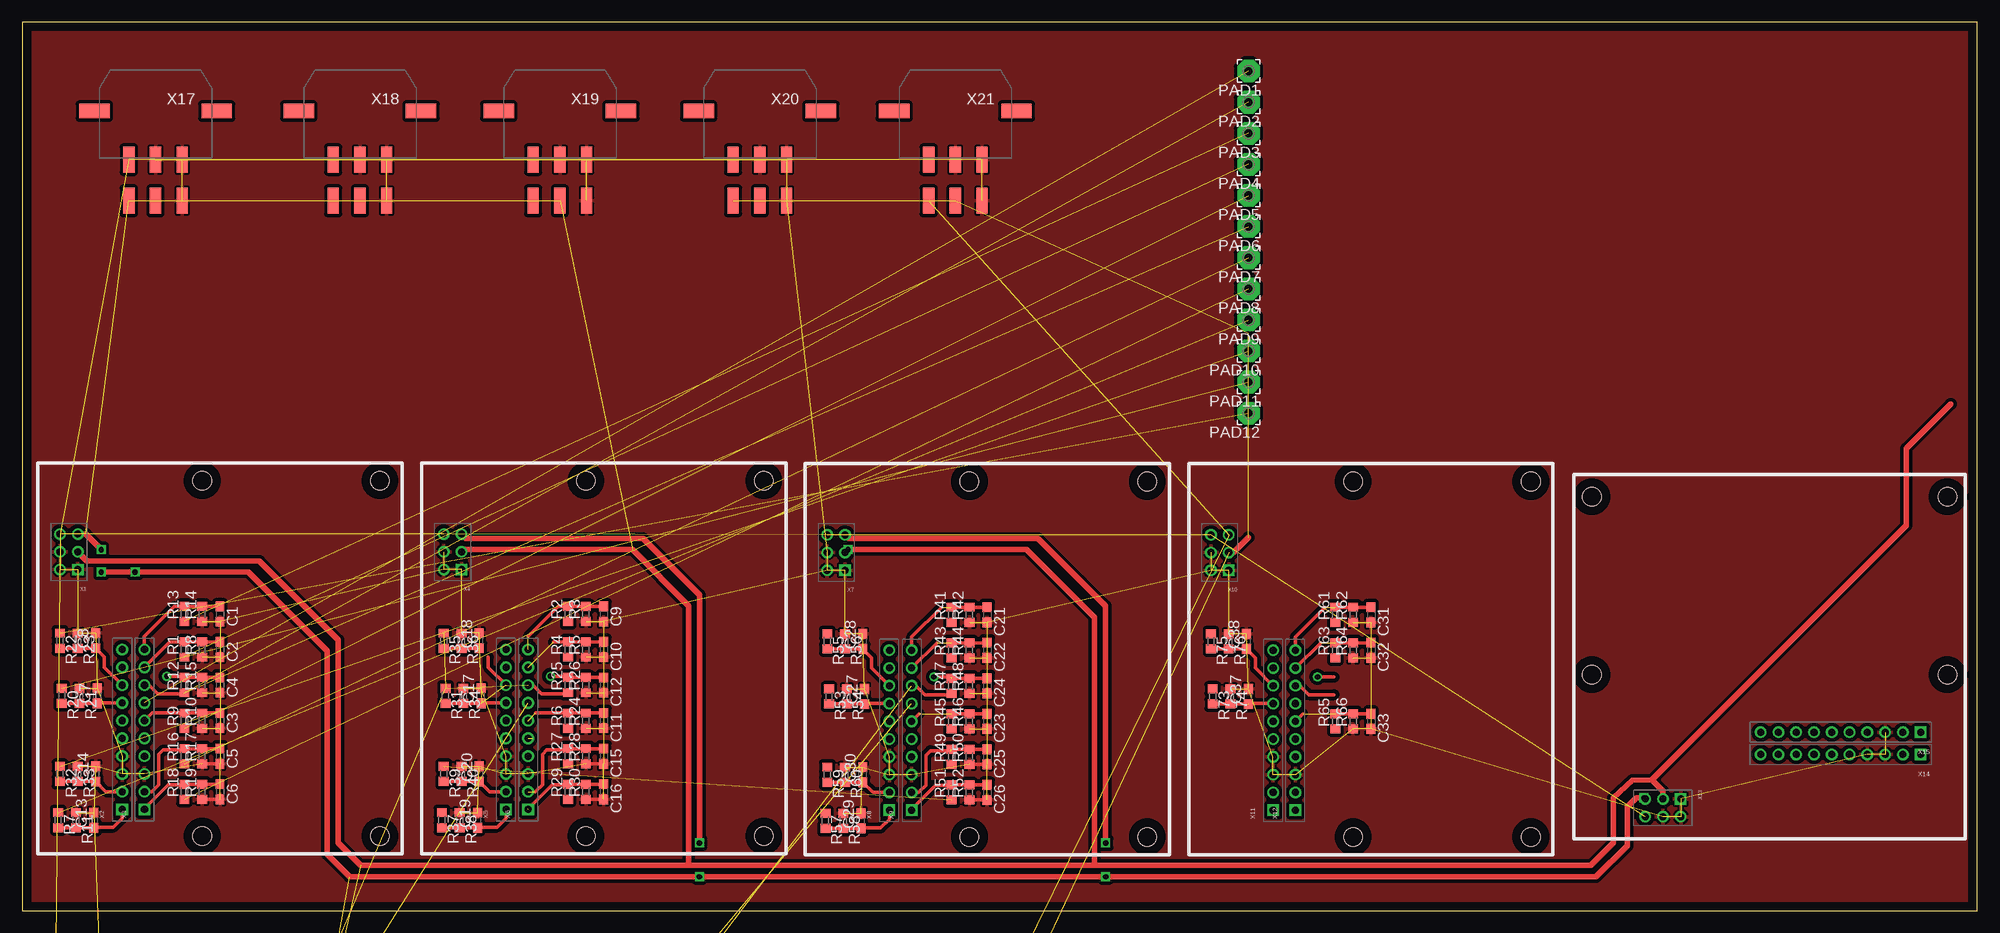
[diagram p7: board, top side]
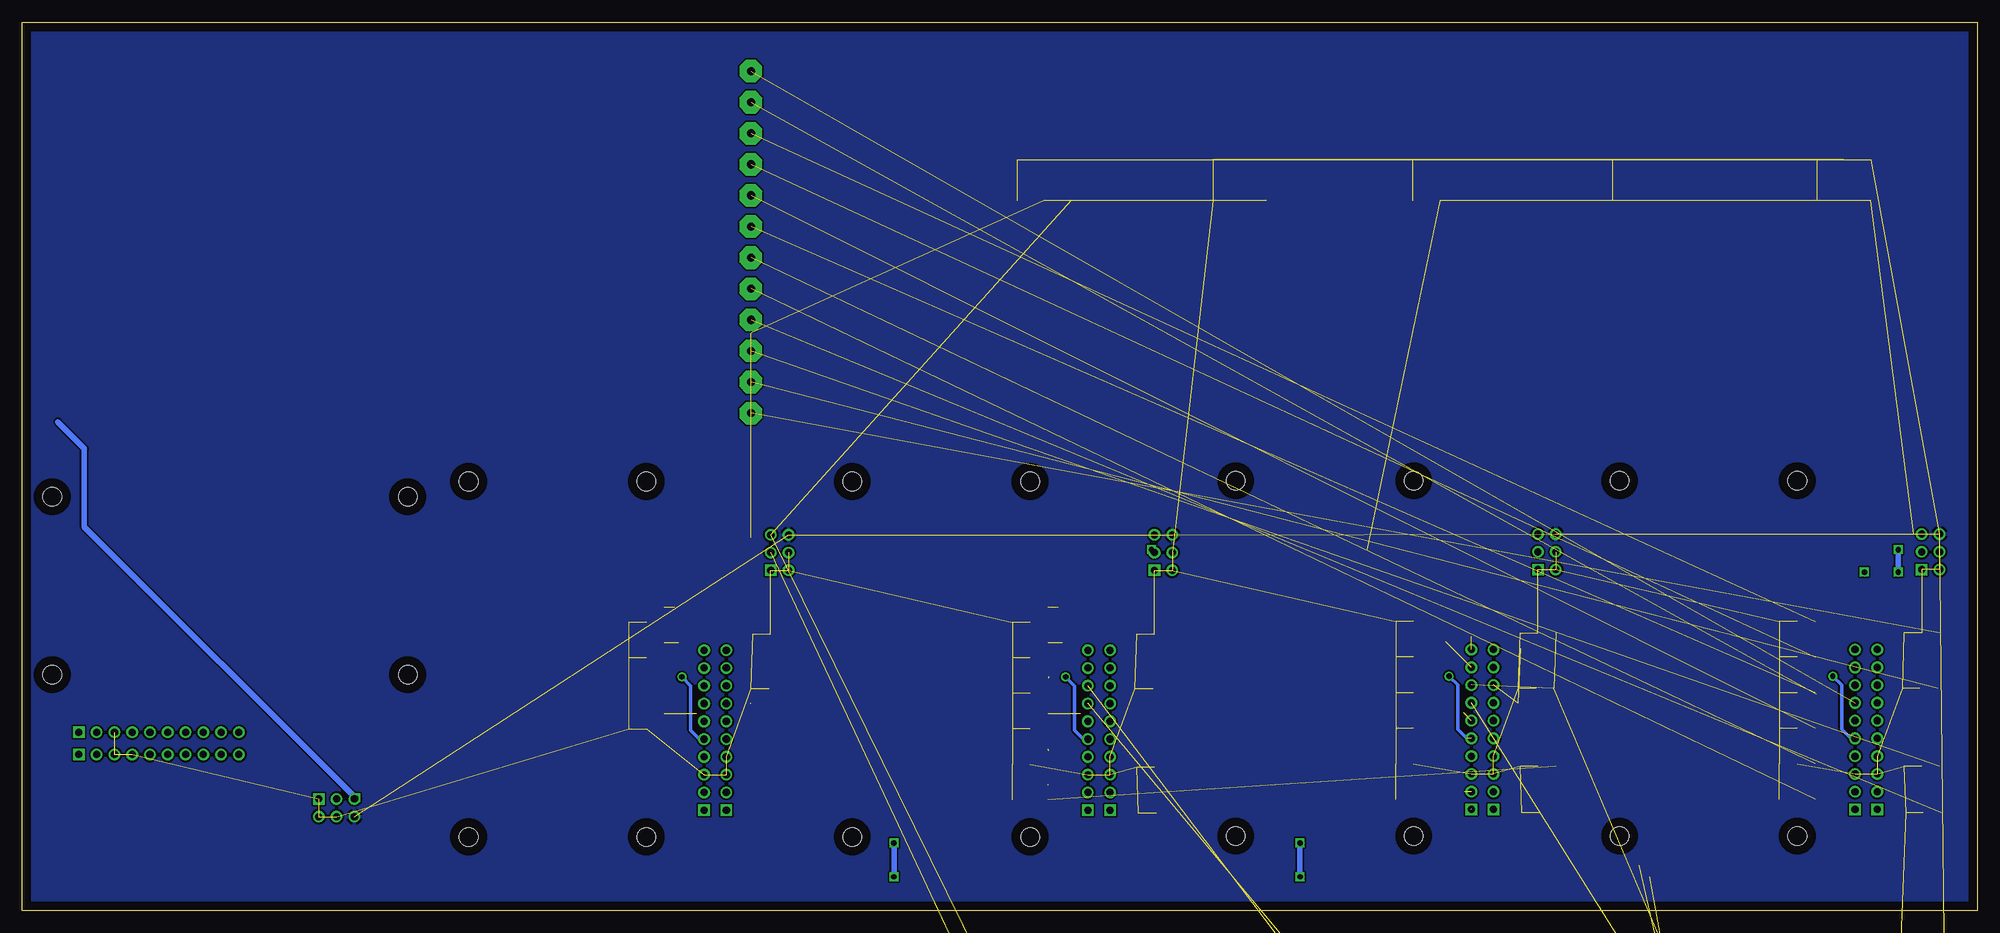
[diagram p8: board, bottom side, seen from below]

Size 220 x 100 mm. Coordinates in mm from the lower left corner, seen from the top.
Outline: 0,0 220,0 220,100 0,100 0,0
Copper layers (1*16): Top 0.035mm / dielectric 1.5mm / Bottom 0.035mm
Design rules "default": minimum track width 10mil, minimum drill 24mil, track to track 8mil, track to pad 8mil, pad to pad 8mil, via to via 8mil, smd to smd 8mil, copper to edge 40mil, drill to drill 8mil, minimum pad ring 10mil, minimum via ring 8mil, stop-mask expansion 4mil, vias tented up to drill 0mil, thermal gap 10mil
Holes 2.1 mm at 20.25,8.38 40.26,8.38 40.26,48.38 20.25,48.38 63.44,8.38 83.44,8.38 83.44,48.38 63.44,48.38 63.44,8.38 83.44,8.38 83.44,48.38 63.44,48.38 106.58,8.3 126.58,8.3 126.58,48.3 106.58,48.3 149.76,8.3 169.76,8.3 169.76,48.3 149.76,48.3 216.62,26.57 216.62,46.58 176.62,46.58 176.62,26.57

### Footprints (pad centres in the part's own frame; a part is rotated, then mirrored left to right if it is on the bottom)
C0603 = smd 1.1 x 1: 1 -0.85,0; 2 0.85,0
2,54/0,9 = drill 0.914 pad 2.54 octagon: 1 0,0
R0603 = smd 1 x 1.1: 1 -0.85,0; 2 0.85,0
M22-71403XX = drill 0.8 square: 1 -1,2 | drill 0.8 round: 2 1,2; 3 -1,0; 4 1,0; 5 -1,-2; 6 1,-2
M22-71310XX = drill 0.8 square: 1 0,-9 | drill 0.8 round: 2 0,-7; 3 0,-5; 4 0,-3; 5 0,-1; 6 0,1; 7 0,3; 8 0,5; 9 0,7; 10 0,9
MICROFIT-6-DUAL-RA-SMD = smd 1.27 x 2.921: 1 3,5.47; 2 0,5.47; 3 -3,5.47; 4 3,10.1; 5 0,10.1; 6 -3,10.1 | smd 3.429 x 1.651: P$9 6.883,0; P$10 -6.883,0

### Placement (x,y rotation side)
C1  22.25,33.38 270 top
C2  22.25,29.39 270 top
C3  22.25,21.39 270 top
C4  22.25,25.39 270 top
C5  22.25,17.39 270 top
C6  22.25,13.38 270 top
C7  8.46,24.18 90 top
C8  8.26,30.39 90 top
C9  65.44,33.38 270 top
C10  65.44,29.39 270 top
C11  65.44,21.39 270 top
C12  65.44,25.39 270 top
C13  8.05,10.19 90 top
C14  8.26,15.38 90 top
C15  65.44,17.39 270 top
C16  65.44,13.38 270 top
C17  51.63,24.18 90 top
C18  51.44,30.39 90 top
C19  51.23,10.19 90 top
C20  51.44,15.38 90 top
C21  108.58,33.3 270 top
C22  108.58,29.3 270 top
C23  108.58,21.3 270 top
C24  108.58,25.3 270 top
C25  108.58,17.3 270 top
C26  108.58,13.3 270 top
C27  94.78,24.11 90 top
C28  94.58,30.3 90 top
C29  94.39,10.11 90 top
C30  94.58,15.3 90 top
C31  151.76,33.3 270 top
C32  151.76,29.3 270 top
C33  151.76,21.3 270 top
C37  137.97,24.11 90 top
C38  137.76,30.3 90 top
PAD1  138,94.5 180 top
PAD2  138,91 180 top
PAD3  138,87.5 180 top
PAD4  138,84 180 top
PAD5  138,80.5 180 top
PAD6  138,77 180 top
PAD7  138,73.5 180 top
PAD8  138,70 180 top
PAD9  138,66.5 180 top
PAD10  138,63 180 top
PAD11  138,59.5 180 top
PAD12  138,56 180 top
PAD13  2.5,-63.5 0 top  (outside the outline)
PAD14  10,-63.5 0 top  (outside the outline)
PAD15  2.5,-68.5 0 top  (outside the outline)
PAD16  10,-68.5 0 top  (outside the outline)
PAD17  2,-73.5 0 top  (outside the outline)
PAD18  9.5,-73.5 0 top  (outside the outline)
PAD19  2,-78.5 0 top  (outside the outline)
PAD20  9.5,-78.5 0 top  (outside the outline)
PAD21  2,-83.5 0 top  (outside the outline)
PAD22  9.5,-83.5 0 top  (outside the outline)
PAD23  2,-88.5 0 top  (outside the outline)
PAD24  9.5,-88.5 0 top  (outside the outline)
PAD25  2.5,-93.5 0 top  (outside the outline)
PAD26  10,-93.5 0 top  (outside the outline)
PAD27  2.5,-98.5 0 top  (outside the outline)
PAD28  10,-98.5 0 top  (outside the outline)
PAD29  2,-103.5 0 top  (outside the outline)
PAD30  9.5,-103.5 0 top  (outside the outline)
PAD31  2,-108.5 0 top  (outside the outline)
PAD32  9.5,-108.5 0 top  (outside the outline)
PAD33  2,-113.5 0 top  (outside the outline)
PAD34  9.5,-113.5 0 top  (outside the outline)
PAD35  2,-118.5 0 top  (outside the outline)
PAD36  9.5,-118.5 0 top  (outside the outline)
PAD37  2.5,-123.5 0 top  (outside the outline)
PAD38  10,-123.5 0 top  (outside the outline)
PAD39  2.5,-128.5 0 top  (outside the outline)
PAD40  10,-128.5 0 top  (outside the outline)
PAD41  2,-133.5 0 top  (outside the outline)
PAD42  9.5,-133.5 0 top  (outside the outline)
PAD43  2,-138.5 0 top  (outside the outline)
PAD44  2.5,-228.5 0 top  (outside the outline)
PAD45  10,-143.5 0 top  (outside the outline)
PAD46  10,-228.5 0 top  (outside the outline)
PAD47  2,-153.5 0 top  (outside the outline)
PAD48  17.5,-228.5 0 top  (outside the outline)
PAD49  2,-163.5 0 top  (outside the outline)
PAD50  2,-233.5 0 top  (outside the outline)
PAD51  2,-173.5 0 top  (outside the outline)
PAD52  9.5,-233.5 0 top  (outside the outline)
PAD53  10,-178.5 0 top  (outside the outline)
PAD54  17,-233.5 0 top  (outside the outline)
PAD55  10,-183.5 0 top  (outside the outline)
PAD56  2,-238.5 0 top  (outside the outline)
PAD57  9.5,-188.5 0 top  (outside the outline)
PAD58  9.5,-238.5 0 top  (outside the outline)
PAD59  9.5,-193.5 0 top  (outside the outline)
PAD60  17,-238.5 0 top  (outside the outline)
PAD61  10,-198.5 0 top  (outside the outline)
PAD62  2,-243.5 0 top  (outside the outline)
PAD63  2,-203.5 0 top  (outside the outline)
PAD64  9.5,-243.5 0 top  (outside the outline)
PAD65  17,-203.5 0 top  (outside the outline)
PAD66  17,-243.5 0 top  (outside the outline)
PAD67  9.5,-208.5 0 top  (outside the outline)
PAD68  2,-248.5 0 top  (outside the outline)
PAD69  2,-213.5 0 top  (outside the outline)
PAD70  9.5,-248.5 0 top  (outside the outline)
PAD71  17,-213.5 0 top  (outside the outline)
PAD72  17,-248.5 0 top  (outside the outline)
PAD73  9.5,-218.5 0 top  (outside the outline)
PAD74  2,-253.5 0 top  (outside the outline)
PAD75  2,-223.5 0 top  (outside the outline)
R1  18.25,29.39 90 top
R2  61.44,33.38 90 top
R3  63.44,33.38 90 top
R4  61.44,29.39 90 top
R5  63.44,29.39 90 top
R6  61.44,21.39 90 top
R7  4.05,10.19 270 top
R8  20.25,29.39 90 top
R9  18.25,21.39 90 top
R10  20.25,21.39 90 top
R11  6.05,10.19 270 top
R12  18.25,25.39 90 top
R13  18.25,33.38 90 top
R14  20.25,33.38 90 top
R15  20.25,25.39 90 top
R16  18.25,17.39 90 top
R17  20.25,17.39 90 top
R18  18.25,13.38 90 top
R19  20.25,13.38 90 top
R20  4.46,24.18 270 top
R21  6.46,24.18 270 top
R22  4.25,30.39 270 top
R23  6.25,30.39 270 top
R24  63.44,21.39 90 top
R25  61.44,25.39 90 top
R26  63.44,25.39 90 top
R27  61.44,17.39 90 top
R28  63.44,17.39 90 top
R29  61.44,13.38 90 top
R30  63.44,13.38 90 top
R31  47.63,24.18 270 top
R32  4.25,15.38 270 top
R33  6.25,15.38 270 top
R34  49.63,24.18 270 top
R35  47.44,30.39 270 top
R36  49.44,30.39 270 top
R37  47.23,10.19 270 top
R38  49.23,10.19 270 top
R39  47.44,15.38 270 top
R40  49.44,15.38 270 top
R41  104.58,33.3 90 top
R42  106.58,33.3 90 top
R43  104.58,29.3 90 top
R44  106.58,29.3 90 top
R45  104.58,21.3 90 top
R46  106.58,21.3 90 top
R47  104.58,25.3 90 top
R48  106.58,25.3 90 top
R49  104.58,17.3 90 top
R50  106.58,17.3 90 top
R51  104.58,13.3 90 top
R52  106.58,13.3 90 top
R53  90.78,24.11 270 top
R54  92.78,24.11 270 top
R55  90.58,30.3 270 top
R56  92.58,30.3 270 top
R57  90.39,10.11 270 top
R58  92.39,10.11 270 top
R59  90.58,15.3 270 top
R60  92.58,15.3 270 top
R61  147.76,33.3 90 top
R62  149.76,33.3 90 top
R63  147.76,29.3 90 top
R64  149.76,29.3 90 top
R65  147.76,21.3 90 top
R66  149.76,21.3 90 top
R73  133.97,24.11 270 top
R74  135.97,24.11 270 top
R75  133.76,30.3 270 top
R76  135.76,30.3 270 top
X1  5.25,40.38 180 top
X2  11.26,20.39 0 top
X3  13.76,20.39 0 top
X4  48.44,40.38 180 top
X5  54.44,20.39 0 top
X6  56.94,20.39 0 top
X7  91.58,40.3 180 top
X8  97.58,20.3 0 top
X9  100.08,20.3 0 top
X10  134.76,40.3 180 top
X11  140.76,20.3 0 top
X12  143.26,20.3 0 top
X13  184.62,11.57 270 top
X14  204.62,17.57 90 top
X15  204.62,20.07 90 top
X17  15,90 180 top
X18  38,90 180 top
X19  60.5,90 180 top
X20  83,90 180 top
X21  105,90 180 top

### Tracks (layer width: path | path; a pad name or v marks a point on that pad's centre or on a via)
3V3_MCN1  (1 unrouted)
  Top 0.406: 18.11,24.39 15.26,24.39 14.26,25.39 X3.8
3V3_MCN2  (3 unrouted)
  Top 0.406: 61.28,24.39 58.44,24.39 57.44,25.39 X6.8
3V3_MCN3  (1 unrouted)
  Top 0.406: 104.44,24.3 101.58,24.3 100.58,25.3 X9.8
3V3_MCN4
  Top 0.406: 147.62,24.3 144.76,24.3 143.76,25.3 X12.8
5V_MCN1  (1 unrouted)
5V_MCN2  (1 unrouted)
5V_MCN3  (1 unrouted)
12V  (23 unrouted)
  pour Bottom: 0,0 220,0 220,100 0,100
AIN2_RCTL  (1 unrouted)
  Top 0.406: C32.1 R64.2 R63.2 | X12.9 146.12,30.16
AIN3_RCTL  (1 unrouted)
  Top 0.406: R65.2 R66.2 C33.1 | X12.6 144.12,22.16
AIN4_RCTL  (via drill 0.6)
  Top 0.406: v145.76,26.3 147.62,26.3
  Bottom 0.406: v145.76,26.3 144.76,25.3 144.76,20.3 143.76,19.3 X12.5
AIN6_MCN2  (1 unrouted)
  Top 0.406: C16.1 R30.2 R29.2 61.38,14.19 59.63,14.19 56.94,11.48
AIN6_MCN3  (1 unrouted)
  Top 0.406: C26.1 R52.2 R51.2 | 104.53,14.11 102.78,14.11 100.08,11.4 X9.1
AIN7_MCN1
  Top 0.406: R7.2 R11.2 C13.1 8.11,9.38 10.26,9.38 11.26,10.38 X2.1
AIN7_MCN2
  Top 0.406: R37.2 R38.2 C19.1 51.28,9.38 53.44,9.38 54.44,10.38 X5.1
AIN7_MCN3
  Top 0.406: R57.2 R58.2 C29.1 94.44,9.3 96.58,9.3 97.58,10.3 X8.1
AIN8_MCN1
  Top 0.406: R32.2 R33.2 C14.1 9.4,13.38 X2.2
AIN8_MCN2
  Top 0.406: R39.2 R40.2 C20.1 52.59,13.38 X5.2
AIN8_MCN3
  Top 0.406: R59.2 R60.2 C30.1 95.73,13.3 X8.2
CAN2_H  (3 unrouted)
CAN2_L  (4 unrouted)
  Top 0.61: 138,42 136.31,40.3 X10.3
CANA_H  (via drill 0.6)  (4 unrouted)
  Top 0.61: X13.5 v182.5,12.7 181.61,12.7 180.71,11.8 180.7,11.8 180.6,11.7 180.6,7.3 177.1,3.8 177,3.8 176.99,3.81 v121.92,3.81 v76.2,3.81 36.83,3.81 34.29,6.35 34.29,29.21 25.4,38.1 v12.7,38.1 v8.89,38.1 | v8.89,40.64 7.14,42.38 X1.5 | X4.5 49.91,41.91 69.85,41.91 76.2,35.56 v76.2,7.62 | X7.5 92.98,41.91 114.3,41.91 121.92,34.29 v121.92,7.62
  Bottom 0.61: v8.89,38.1 v8.89,40.64 | v76.2,3.81 v76.2,7.62 | v121.92,3.81 v121.92,7.62 | v182.5,12.7 213,43.2 213,52 216,55
CANA_L  (via drill 0.6)  (4 unrouted)
  Top 0.61: X1.3 7.27,39.37 26.67,39.37 35.56,30.48 35.56,7.62 38.1,5.08 75,5.08 | 120.65,5.08 75,5.08 | 120.65,5.08 176.53,5.08 179.07,7.62 179.07,12.7 181.21,14.64 183.38,14.74 | 183.38,14.74 184.62,13.49 X13.3 | v92.92,40.64 113.03,40.64 120.65,33.02 120.65,5.08 | 75,5.08 75,34.29 68.66,40.64 49.69,40.64 X4.3 | 183.38,14.74 212,43.36 212,52 217,57
  Bottom 0.61: v92.92,40.64 X7.3
FLEX1_MCN3  (1 unrouted)
  Top 0.406: R45.2 R46.2 C23.1 | X9.6 100.94,22.16
FLEX2_MCN3  (via drill 0.6)  (1 unrouted)
  Top 0.406: C24.1 R48.2 R47.2 | v102.58,26.3 104.44,26.3
  Bottom 0.406: v102.58,26.3 101.58,25.3 101.58,20.3 100.58,19.3 X9.5
FLEX3_MCN3  (1 unrouted)
  Top 0.406: R49.2 R50.2 C25.1 | 104.44,18 102.19,18 101.69,17.5 101.69,14.11 100.89,13.3 X9.2
FLOW_MCTLLOOP_MCN2  (1 unrouted)
  Top 0.406: R35.2 R36.2 C18.1 | 51.69,23.39 X5.7
FLOW_MTRLOOP_MCN2  (1 unrouted)
  Top 0.406: R31.2 R34.2 C17.1 | 52.44,28.54 52.44,27.39 X5.8
GND  (122 unrouted)
  Top 0.406: R19.1 C6.2 | R17.1 C5.2 | R30.1 C16.2 | R28.1 C15.2 | R52.1 C26.2 | R50.1 C25.2
  pour Top (isolate 0.406): 0,0 220,0 220,100 0,100
GP0_MCN1
  Top 0.406: R20.2 R21.2 C7.1 8.51,23.39 X2.7
GP0_MCN3
  Top 0.406: R53.2 R54.2 C27.1 94.83,23.3 X8.7
GP1_MCN1
  Top 0.406: R22.2 R23.2 C8.1 9.26,28.54 9.26,27.39 X2.8
GP1_MCN3
  Top 0.406: R55.2 R56.2 C28.1 95.58,28.45 95.58,27.3 X8.8
GP1_MCN4
  Top 0.406: R75.2 R76.2 C38.1 138.76,28.45 138.76,27.3 X11.8
PRES_AMB  (1 unrouted)
PRES_AMB_MCN1
  Top 0.406: C5.1 R17.2 R16.2 18.11,18.09 15.86,18.09 15.36,17.59 15.36,14.19 14.55,13.38 X3.2
PRES_MTR_IN  (1 unrouted)
PRES_MTR_IN_MCN1
  Top 0.406: C6.1 R19.2 R18.2 18.2,14.19 16.45,14.19 13.76,11.48 X3.1
STEER_ANG  (1 unrouted)
STEER_ANG_MCN1
  Top 0.406: C3.1 R10.2 R9.2 14.61,22.23 X3.6
SUSP_FRNT  (1 unrouted)
SUSP_FRNT_MCN1
  Top 0.406: C1.1 R14.2 R13.2 17.11,34.23 13.76,30.89 X3.10
SUSP_REAR  (1 unrouted)
SUSP_REAR_MCN1
  Top 0.406: C2.1 R8.2 R1.2 16.61,30.23 X3.9
TEMP_AMB  (1 unrouted)
TEMP_AMB_MCN1  (via drill 0.6)
  Top 0.406: C4.1 R15.2 R12.2 18.11,26.39 v16.25,26.39
  Bottom 0.406: v16.25,26.39 15.26,25.39 15.26,20.39 14.26,19.39 X3.5
TEMP_CLNT_MCTL_IN_MCN2  (1 unrouted)
  Top 0.406: C11.1 R24.2 R6.2 57.78,22.23
TEMP_CLNT_MCTL_OUT_MCN2  (via drill 0.6)  (1 unrouted)
  Top 0.406: C12.1 R26.2 R25.2 61.28,26.39 v59.44,26.39
  Bottom 0.406: v59.44,26.39 58.44,25.39 58.44,20.39 57.44,19.39
TEMP_CLNT_MTR_IN_MCN2  (1 unrouted)
  Top 0.406: C9.1 R3.2 R2.2 60.28,34.23 56.94,30.89
TEMP_CLNT_MTR_OUT_MCN2  (1 unrouted)
  Top 0.406: C10.1 R5.2 R4.2 59.78,30.23
TEMP_CONTACTOR_BOX_MCN2  (1 unrouted)
  Top 0.406: C15.1 R28.2 R27.2 61.28,18.09 59.03,18.09 58.53,17.59 58.53,14.19 57.73,13.38
TEMP_TIRE_FRNT_MCN3  (1 unrouted)
  Top 0.406: C21.1 R42.2 R41.2 | X9.10 100.08,30.8 103.44,34.16
TEMP_TIRE_REAR_MCN3  (1 unrouted)
  Top 0.406: C22.1 R44.2 R43.2 | X9.9 102.94,30.16
THRTL_EN_RCTL  (1 unrouted)
  Top 0.406: R73.2 R74.2 C37.1 | 138.01,23.3 X11.7
THRTL_POS_RCTL  (1 unrouted)
  Top 0.406: C31.1 R62.2 R61.2 | X12.10 143.26,30.8 146.62,34.16
UNUSED_A1  (1 unrouted)
UNUSED_A2  (1 unrouted)
UNUSED_A5  (1 unrouted)
UNUSED_GP1  (1 unrouted)
UNUSED_GP2  (1 unrouted)